# EAGLE schematic module_flags_calc (EAGLE 6.5.0)

## Sheet 1 of 14
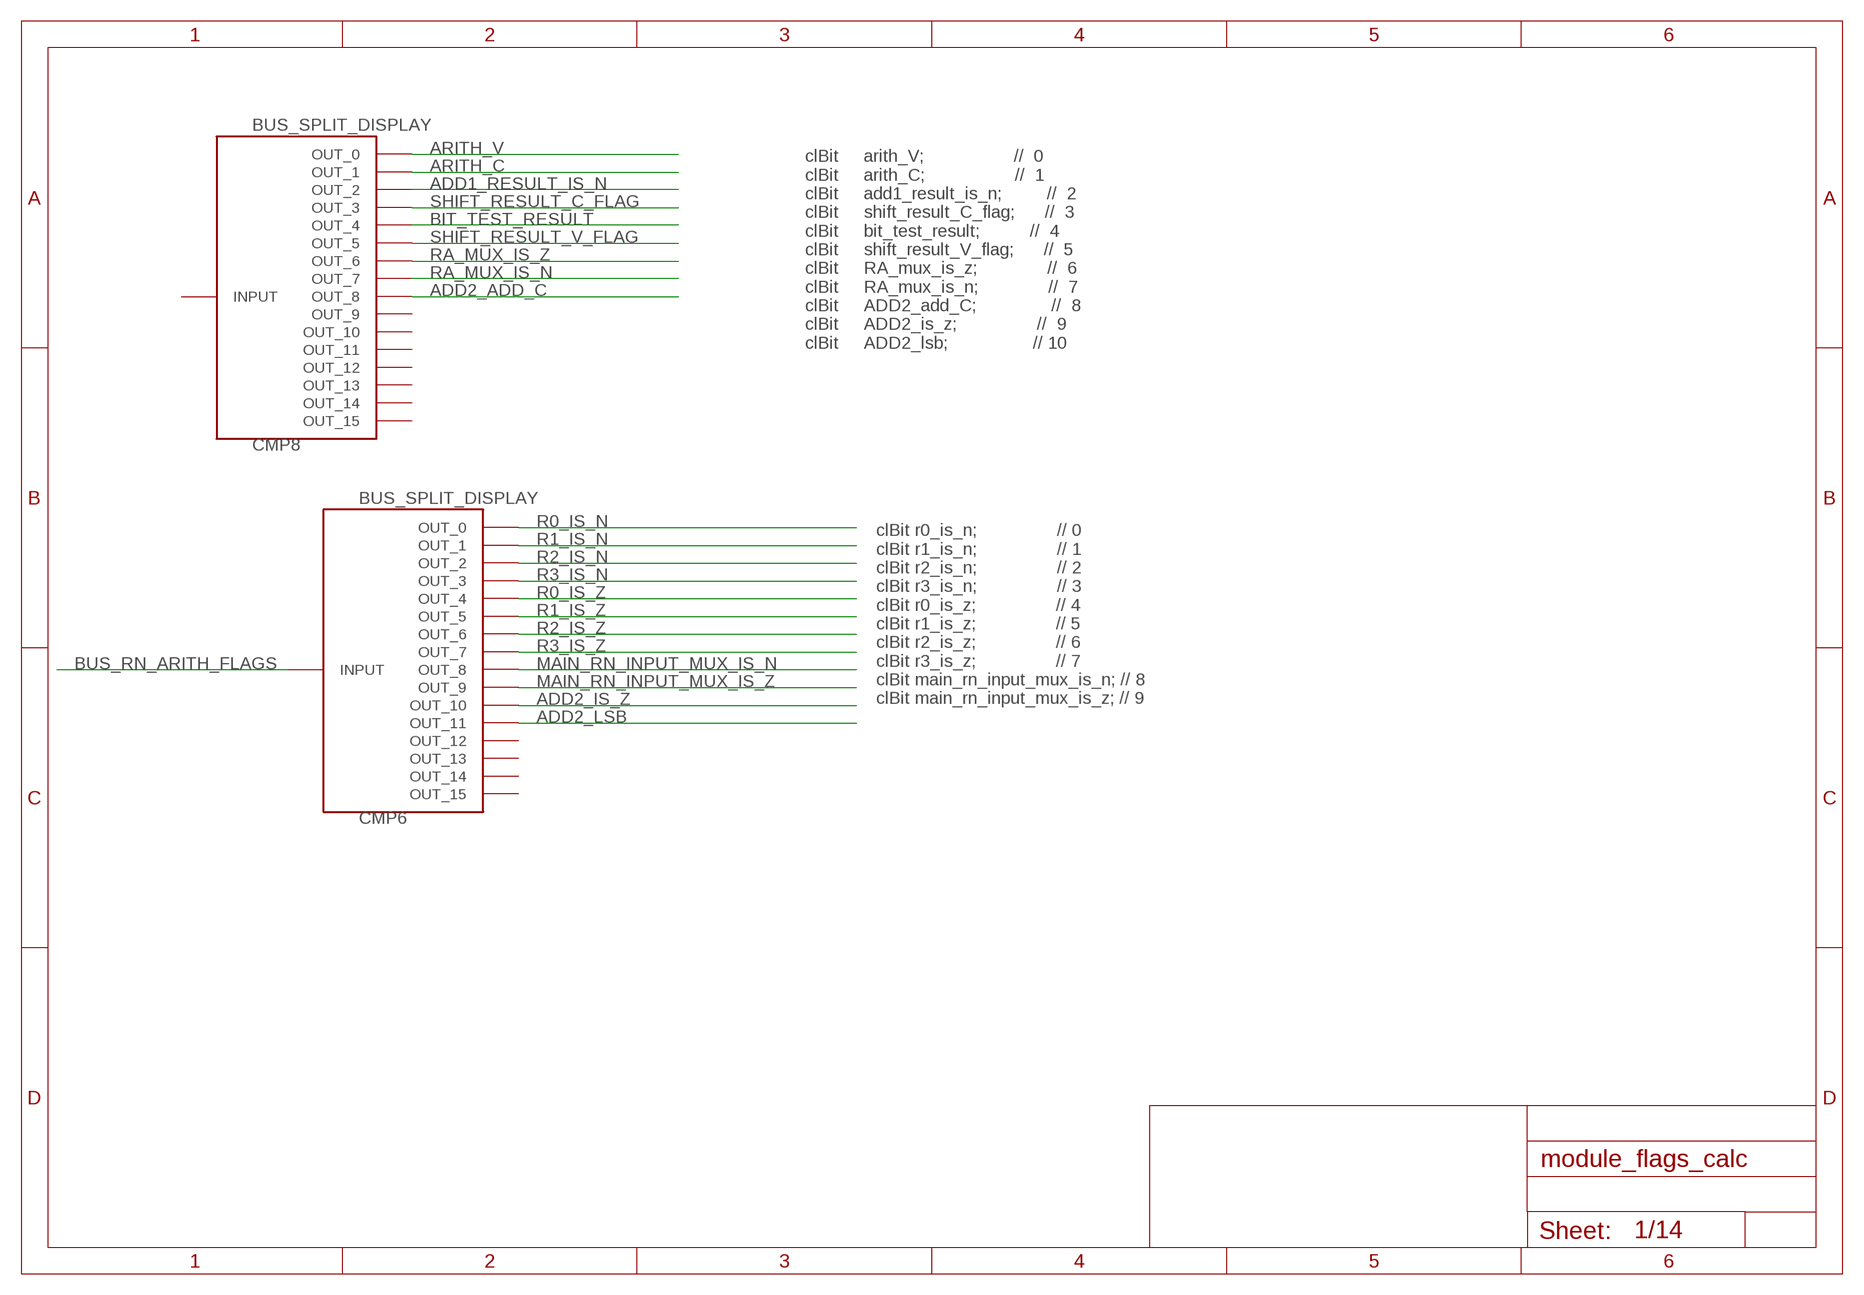
[diagram p0: schematic, sheet 1]

### Parts
CMP6  BUS_SPLIT_DISPLAY  [BUS_SPLIT_DISPLAY]
CMP8  BUS_SPLIT_DISPLAY  [BUS_SPLIT_DISPLAY]

### Nets
ADD1_RESULT_IS_N: CMP8.P$3(OUT_2) ; also sheet 7
ADD2_ADD_C: CMP8.P$9(OUT_8) ; also sheet 9
ADD2_IS_Z: CMP6.P$11(OUT_10) ; also sheet 11
ADD2_LSB: CMP6.P$12(OUT_11) ; also sheet 8
ARITH_C: CMP8.P$2(OUT_1) ; also sheet 8
ARITH_V: CMP8.P$1(OUT_0) ; also sheet 7
BIT_TEST_RESULT: CMP8.P$5(OUT_4) ; also sheet 11
BUS_RN_ARITH_FLAGS: CMP6.INPUT
MAIN_RN_INPUT_MUX_IS_N: CMP6.P$9(OUT_8) ; also sheet 10
MAIN_RN_INPUT_MUX_IS_Z: CMP6.P$10(OUT_9) ; also sheet 5,11
R0_IS_N: CMP6.P$1(OUT_0) ; also sheet 12
R0_IS_Z: CMP6.P$5(OUT_4)
R1_IS_N: CMP6.P$2(OUT_1) ; also sheet 12
R1_IS_Z: CMP6.P$6(OUT_5)
R2_IS_N: CMP6.P$3(OUT_2)
R2_IS_Z: CMP6.P$7(OUT_6)
R3_IS_N: CMP6.P$4(OUT_3)
R3_IS_Z: CMP6.P$8(OUT_7)
RA_MUX_IS_N: CMP8.P$8(OUT_7) ; also sheet 8,9,10
RA_MUX_IS_Z: CMP8.P$7(OUT_6) ; also sheet 11
SHIFT_RESULT_C_FLAG: CMP8.P$4(OUT_3) ; also sheet 8
SHIFT_RESULT_V_FLAG: CMP8.P$6(OUT_5) ; also sheet 5
Unconnected: CMP6.P$13(OUT_12) CMP6.P$14(OUT_13) CMP6.P$15(OUT_14) CMP6.P$16(OUT_15) CMP8.INPUT CMP8.P$10(OUT_9) CMP8.P$11(OUT_10) CMP8.P$12(OUT_11) CMP8.P$13(OUT_12) CMP8.P$14(OUT_13) CMP8.P$15(OUT_14) CMP8.P$16(OUT_15)

### Notes on the sheet
- clBit     arith_V;                  //  0
      clBit     arith_C;                  //  1
      clBit     add1_result_is_n;         //  2
      clBit     shift_result_C_flag;      //  3
      clBit     bit_test_result;          //  4
      clBit     shift_result_V_flag;      //  5
      clBit     RA_mux_is_z;              //  6
      clBit     RA_mux_is_n;              //  7
      clBit     ADD2_add_C;               //  8
      clBit     ADD2_is_z;                //  9
      clBit     ADD2_lsb;                 // 10
- clBit r0_is_n;                // 0
      clBit r1_is_n;                // 1
      clBit r2_is_n;                // 2
      clBit r3_is_n;                // 3
      clBit r0_is_z;                // 4
      clBit r1_is_z;                // 5
      clBit r2_is_z;                // 6
      clBit r3_is_z;                // 7
      clBit main_rn_input_mux_is_n; // 8 
      clBit main_rn_input_mux_is_z; // 9

## Sheet 2 of 14
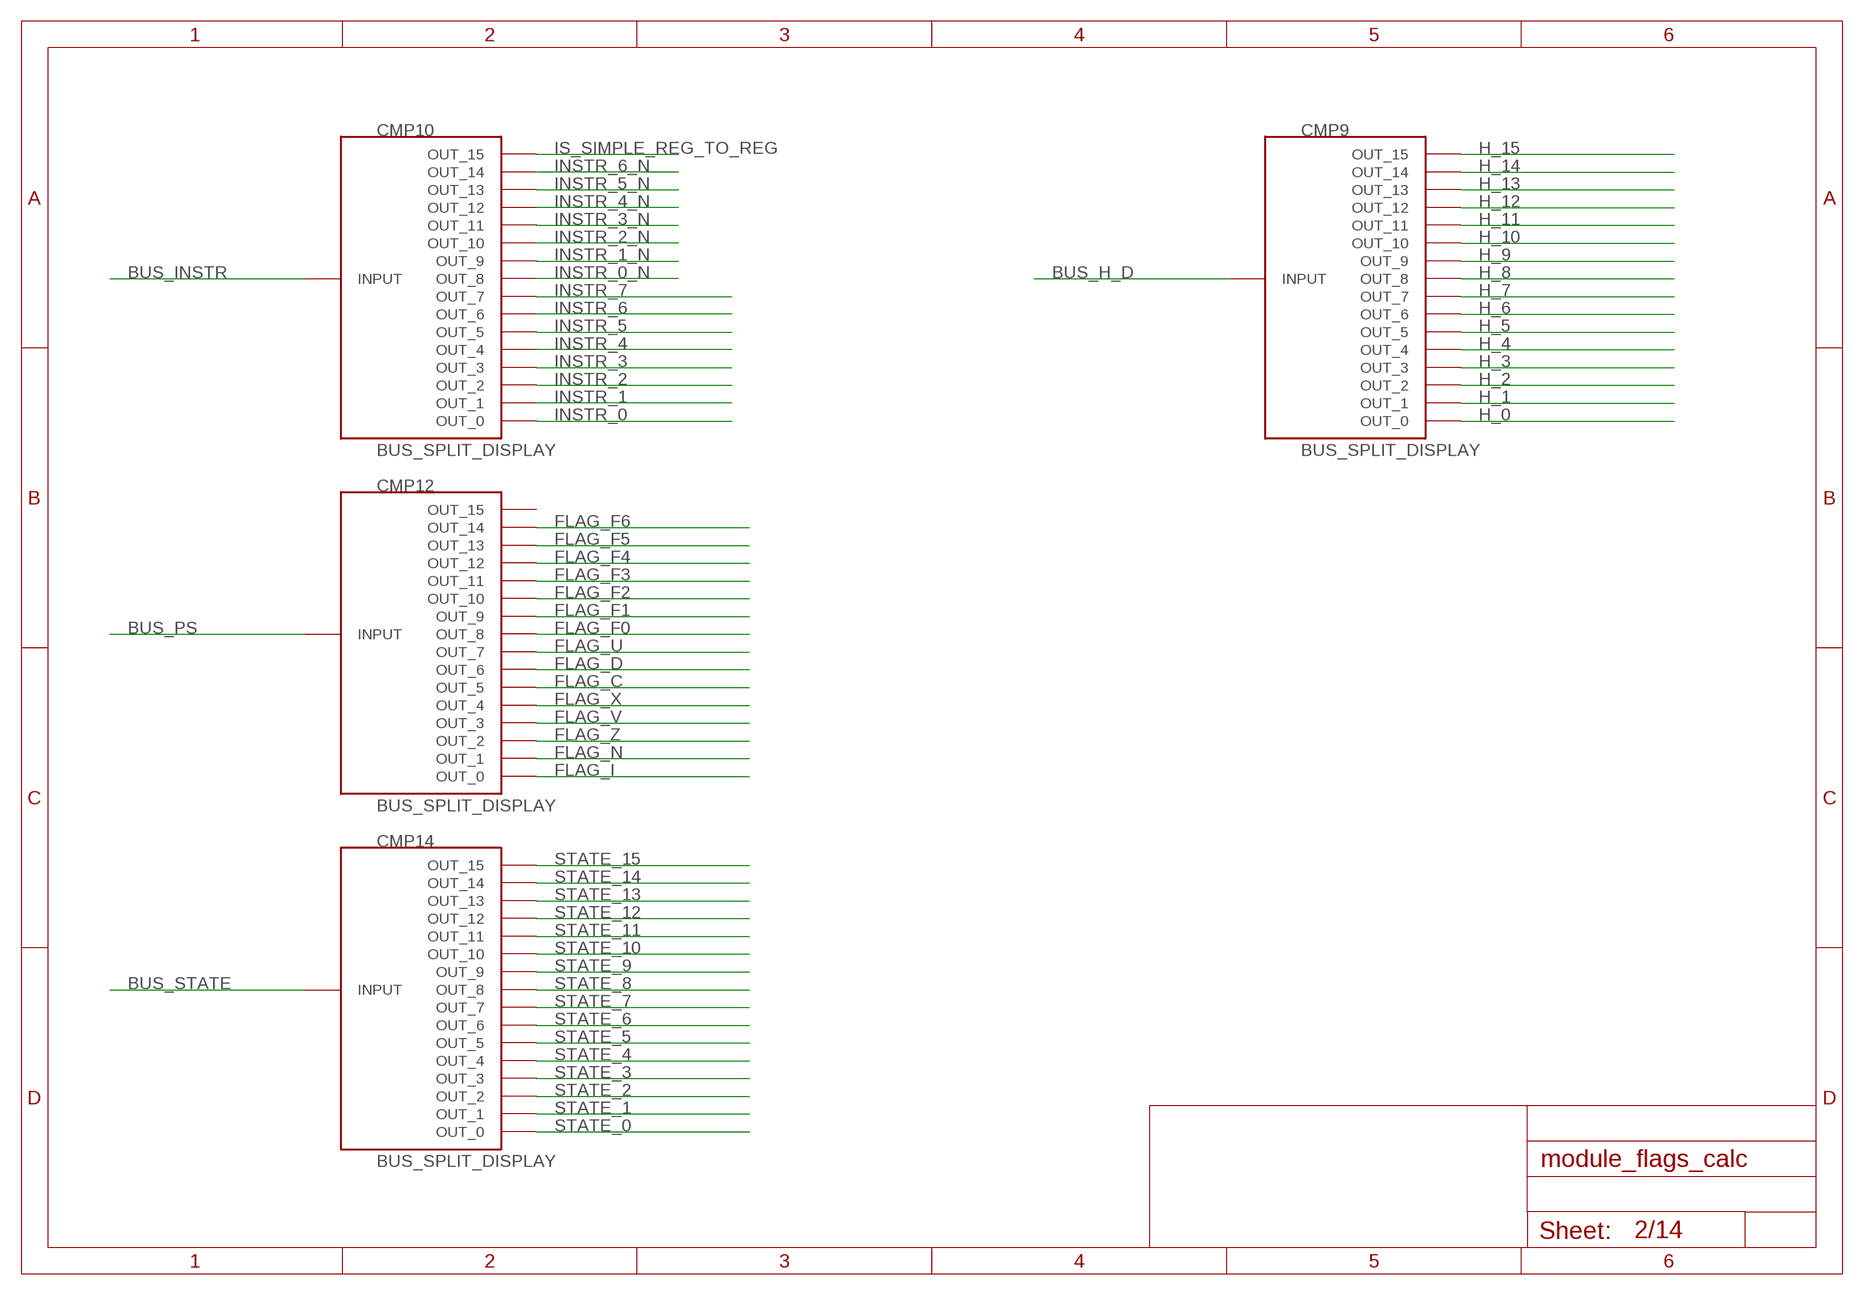
[diagram p1: schematic, sheet 2]

### Parts
CMP9  BUS_SPLIT_DISPLAY  [BUS_SPLIT_DISPLAY]
CMP10  BUS_SPLIT_DISPLAY  [BUS_SPLIT_DISPLAY]
CMP12  BUS_SPLIT_DISPLAY  [BUS_SPLIT_DISPLAY]
CMP14  BUS_SPLIT_DISPLAY  [BUS_SPLIT_DISPLAY]

### Nets
BUS_H_D: CMP9.INPUT
BUS_INSTR: CMP10.INPUT
BUS_PS: CMP12.INPUT
BUS_STATE: CMP14.INPUT
FLAG_C: CMP12.P$6(OUT_5) ; also sheet 8
FLAG_D: CMP12.P$7(OUT_6) ; also sheet 4
FLAG_F0: CMP12.P$9(OUT_8) ; also sheet 12
FLAG_F1: CMP12.P$10(OUT_9) ; also sheet 12
FLAG_F2: CMP12.P$11(OUT_10)
FLAG_F3: CMP12.P$12(OUT_11)
FLAG_F4: CMP12.P$13(OUT_12) ; also sheet 13
FLAG_F5: CMP12.P$14(OUT_13) ; also sheet 13
FLAG_F6: CMP12.P$15(OUT_14) ; also sheet 8,13
FLAG_I: CMP12.P$1(OUT_0) ; also sheet 5
FLAG_N: CMP12.P$2(OUT_1) ; also sheet 10
FLAG_U: CMP12.P$8(OUT_7) ; also sheet 4
FLAG_V: CMP12.P$4(OUT_3) ; also sheet 5,7
FLAG_X: CMP12.P$5(OUT_4) ; also sheet 8,9
FLAG_Z: CMP12.P$3(OUT_2) ; also sheet 5,11
H_0: CMP9.P$1(OUT_0)
H_1: CMP9.P$2(OUT_1)
H_2: CMP9.P$3(OUT_2)
H_3: CMP9.P$4(OUT_3) ; also sheet 13
H_4: CMP9.P$5(OUT_4) ; also sheet 7
H_5: CMP9.P$6(OUT_5) ; also sheet 13
H_6: CMP9.P$7(OUT_6)
H_7: CMP9.P$8(OUT_7)
H_8: CMP9.P$9(OUT_8)
H_9: CMP9.P$10(OUT_9)
H_10: CMP9.P$11(OUT_10)
H_11: CMP9.P$12(OUT_11)
H_12: CMP9.P$13(OUT_12)
H_13: CMP9.P$14(OUT_13)
H_14: CMP9.P$15(OUT_14)
H_15: CMP9.P$16(OUT_15)
INSTR_0: CMP10.P$1(OUT_0) ; also sheet 3
INSTR_0_N: CMP10.P$9(OUT_8)
INSTR_1: CMP10.P$2(OUT_1) ; also sheet 3
INSTR_1_N: CMP10.P$10(OUT_9)
INSTR_2: CMP10.P$3(OUT_2) ; also sheet 3
INSTR_2_N: CMP10.P$11(OUT_10)
INSTR_3: CMP10.P$4(OUT_3) ; also sheet 3,10
INSTR_3_N: CMP10.P$12(OUT_11)
INSTR_4: CMP10.P$5(OUT_4)
INSTR_4_N: CMP10.P$13(OUT_12)
INSTR_5: CMP10.P$6(OUT_5)
INSTR_5_N: CMP10.P$14(OUT_13)
INSTR_6: CMP10.P$7(OUT_6)
INSTR_6_N: CMP10.P$15(OUT_14) ; also sheet 6
INSTR_7: CMP10.P$8(OUT_7)
IS_SIMPLE_REG_TO_REG: CMP10.P$16(OUT_15) ; also sheet 10
STATE_0: CMP14.P$1(OUT_0) ; also sheet 6,10,12
STATE_1: CMP14.P$2(OUT_1) ; also sheet 13
STATE_2: CMP14.P$3(OUT_2)
STATE_3: CMP14.P$4(OUT_3) ; also sheet 5,6,8,11,14
STATE_4: CMP14.P$5(OUT_4)
STATE_5: CMP14.P$6(OUT_5) ; also sheet 14
STATE_6: CMP14.P$7(OUT_6)
STATE_7: CMP14.P$8(OUT_7)
STATE_8: CMP14.P$9(OUT_8) ; also sheet 14
STATE_9: CMP14.P$10(OUT_9) ; also sheet 5
STATE_10: CMP14.P$11(OUT_10)
STATE_11: CMP14.P$12(OUT_11)
STATE_12: CMP14.P$13(OUT_12)
STATE_13: CMP14.P$14(OUT_13) ; also sheet 9,12
STATE_14: CMP14.P$15(OUT_14)
STATE_15: CMP14.P$16(OUT_15)
Unconnected: CMP12.P$16(OUT_15)

## Sheet 3 of 14
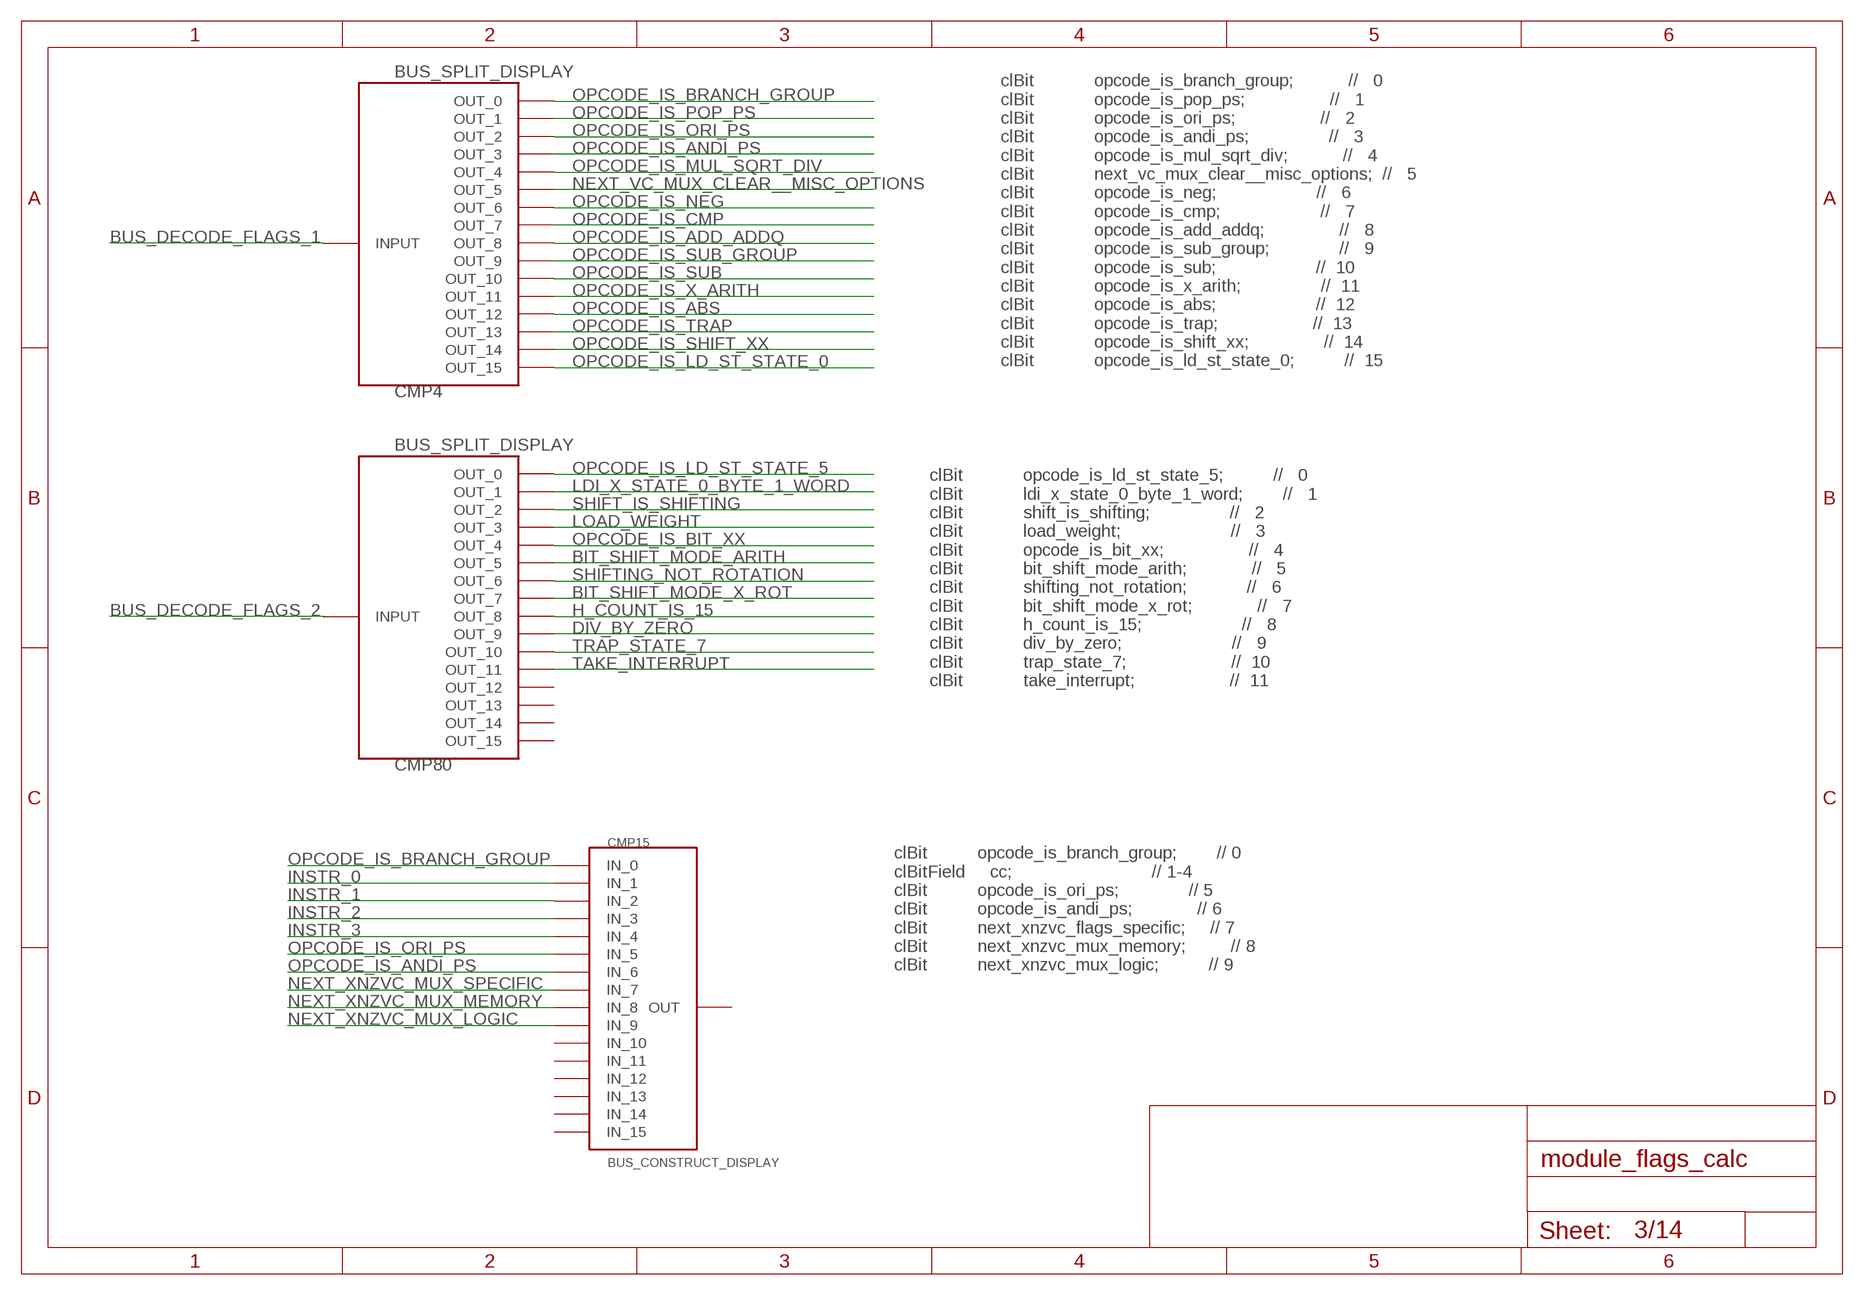
[diagram p2: schematic, sheet 3]

### Parts
CMP4  BUS_SPLIT_DISPLAY  [BUS_SPLIT_DISPLAY]
CMP15  BUS_CONSTRUCT_DISPLAY  [BUS_SPLIT_DISPLAY]
CMP80  BUS_SPLIT_DISPLAY  [BUS_SPLIT_DISPLAY]

### Nets
BIT_SHIFT_MODE_ARITH: CMP80.P$6(OUT_5) ; also sheet 7
BIT_SHIFT_MODE_X_ROT: CMP80.P$8(OUT_7) ; also sheet 8
BUS_DECODE_FLAGS_1: CMP4.INPUT
BUS_DECODE_FLAGS_2: CMP80.INPUT
DIV_BY_ZERO: CMP80.P$10(OUT_9) ; also sheet 13
H_COUNT_IS_15: CMP80.P$9(OUT_8) ; also sheet 12
INSTR_0: CMP15.P$2(IN_1) ; also sheet 2
INSTR_1: CMP15.P$3(IN_2) ; also sheet 2
INSTR_2: CMP15.P$4(IN_3) ; also sheet 2
INSTR_3: CMP15.P$5(IN_4) ; also sheet 2,10
LDI_X_STATE_0_BYTE_1_WORD: CMP80.P$2(OUT_1) ; also sheet 10
LOAD_WEIGHT: CMP80.P$4(OUT_3) ; also sheet 7,8,9,10,11
NEXT_VC_MUX_CLEAR__MISC_OPTIONS: CMP4.P$6(OUT_5) ; also sheet 6
NEXT_XNZVC_MUX_LOGIC: CMP15.P$10(IN_9) ; also sheet 14
NEXT_XNZVC_MUX_MEMORY: CMP15.P$9(IN_8) ; also sheet 14
NEXT_XNZVC_MUX_SPECIFIC: CMP15.P$8(IN_7) ; also sheet 14
OPCODE_IS_ABS: CMP4.P$13(OUT_12) ; also sheet 6,7,8,9
OPCODE_IS_ADD_ADDQ: CMP4.P$9(OUT_8) ; also sheet 5,9
OPCODE_IS_ANDI_PS: CMP4.P$4(OUT_3) CMP15.P$7(IN_6) ; also sheet 14
OPCODE_IS_BIT_XX: CMP80.P$5(OUT_4) ; also sheet 11
OPCODE_IS_BRANCH_GROUP: CMP4.P$1(OUT_0) CMP15.P$1(IN_0)
OPCODE_IS_CMP: CMP4.P$8(OUT_7) ; also sheet 5
OPCODE_IS_LD_ST_STATE_0: CMP4.P$16(OUT_15) ; also sheet 10
OPCODE_IS_LD_ST_STATE_5: CMP80.P$1(OUT_0) ; also sheet 10
OPCODE_IS_MUL_SQRT_DIV: CMP4.P$5(OUT_4) ; also sheet 5,6
OPCODE_IS_NEG: CMP4.P$7(OUT_6) ; also sheet 5
OPCODE_IS_ORI_PS: CMP4.P$3(OUT_2) CMP15.P$6(IN_5) ; also sheet 14
OPCODE_IS_POP_PS: CMP4.P$2(OUT_1) ; also sheet 14
OPCODE_IS_SHIFT_XX: CMP4.P$15(OUT_14) ; also sheet 8,10
OPCODE_IS_SUB: CMP4.P$11(OUT_10) ; also sheet 5
OPCODE_IS_SUB_GROUP: CMP4.P$10(OUT_9) ; also sheet 9
OPCODE_IS_TRAP: CMP4.P$14(OUT_13) ; also sheet 5
OPCODE_IS_X_ARITH: CMP4.P$12(OUT_11) ; also sheet 5,9,10,11
SHIFT_IS_SHIFTING: CMP80.P$3(OUT_2) ; also sheet 7,8,10
SHIFTING_NOT_ROTATION: CMP80.P$7(OUT_6) ; also sheet 9
TAKE_INTERRUPT: CMP80.P$12(OUT_11) ; also sheet 13
TRAP_STATE_7: CMP80.P$11(OUT_10) ; also sheet 13
Unconnected: CMP15.INPUT(OUT) CMP15.P$11(IN_10) CMP15.P$12(IN_11) CMP15.P$13(IN_12) CMP15.P$14(IN_13) CMP15.P$15(IN_14) CMP15.P$16(IN_15) CMP80.P$13(OUT_12) CMP80.P$14(OUT_13) CMP80.P$15(OUT_14) CMP80.P$16(OUT_15)

### Notes on the sheet
- clBit            opcode_is_branch_group;           //   0
      clBit            opcode_is_pop_ps;                 //   1
      clBit            opcode_is_ori_ps;                 //   2
      clBit            opcode_is_andi_ps;                //   3
      clBit            opcode_is_mul_sqrt_div;           //   4
      clBit            next_vc_mux_clear__misc_options;  //   5
      clBit            opcode_is_neg;                    //   6
      clBit            opcode_is_cmp;                    //   7
      clBit            opcode_is_add_addq;               //   8
      clBit            opcode_is_sub_group;              //   9
      clBit            opcode_is_sub;                    //  10
      clBit            opcode_is_x_arith;                //  11
      clBit            opcode_is_abs;                    //  12
      clBit            opcode_is_trap;                   //  13
      clBit            opcode_is_shift_xx;               //  14
      clBit            opcode_is_ld_st_state_0;          //  15
- clBit            opcode_is_ld_st_state_5;          //   0
      clBit            ldi_x_state_0_byte_1_word;        //   1
      clBit            shift_is_shifting;                //   2
      clBit            load_weight;                      //   3
      clBit            opcode_is_bit_xx;                 //   4
      clBit            bit_shift_mode_arith;             //   5
      clBit            shifting_not_rotation;            //   6
      clBit            bit_shift_mode_x_rot;             //   7
      clBit            h_count_is_15;                    //   8
      clBit            div_by_zero;                      //   9
      clBit            trap_state_7;                     //  10
      clBit            take_interrupt;                   //  11
- clBit          opcode_is_branch_group;        // 0
      clBitField     cc;                            // 1-4
      clBit          opcode_is_ori_ps;              // 5
      clBit          opcode_is_andi_ps;             // 6
      clBit          next_xnzvc_flags_specific;     // 7
      clBit          next_xnzvc_mux_memory;         // 8
      clBit          next_xnzvc_mux_logic;          // 9

## Sheet 4 of 14
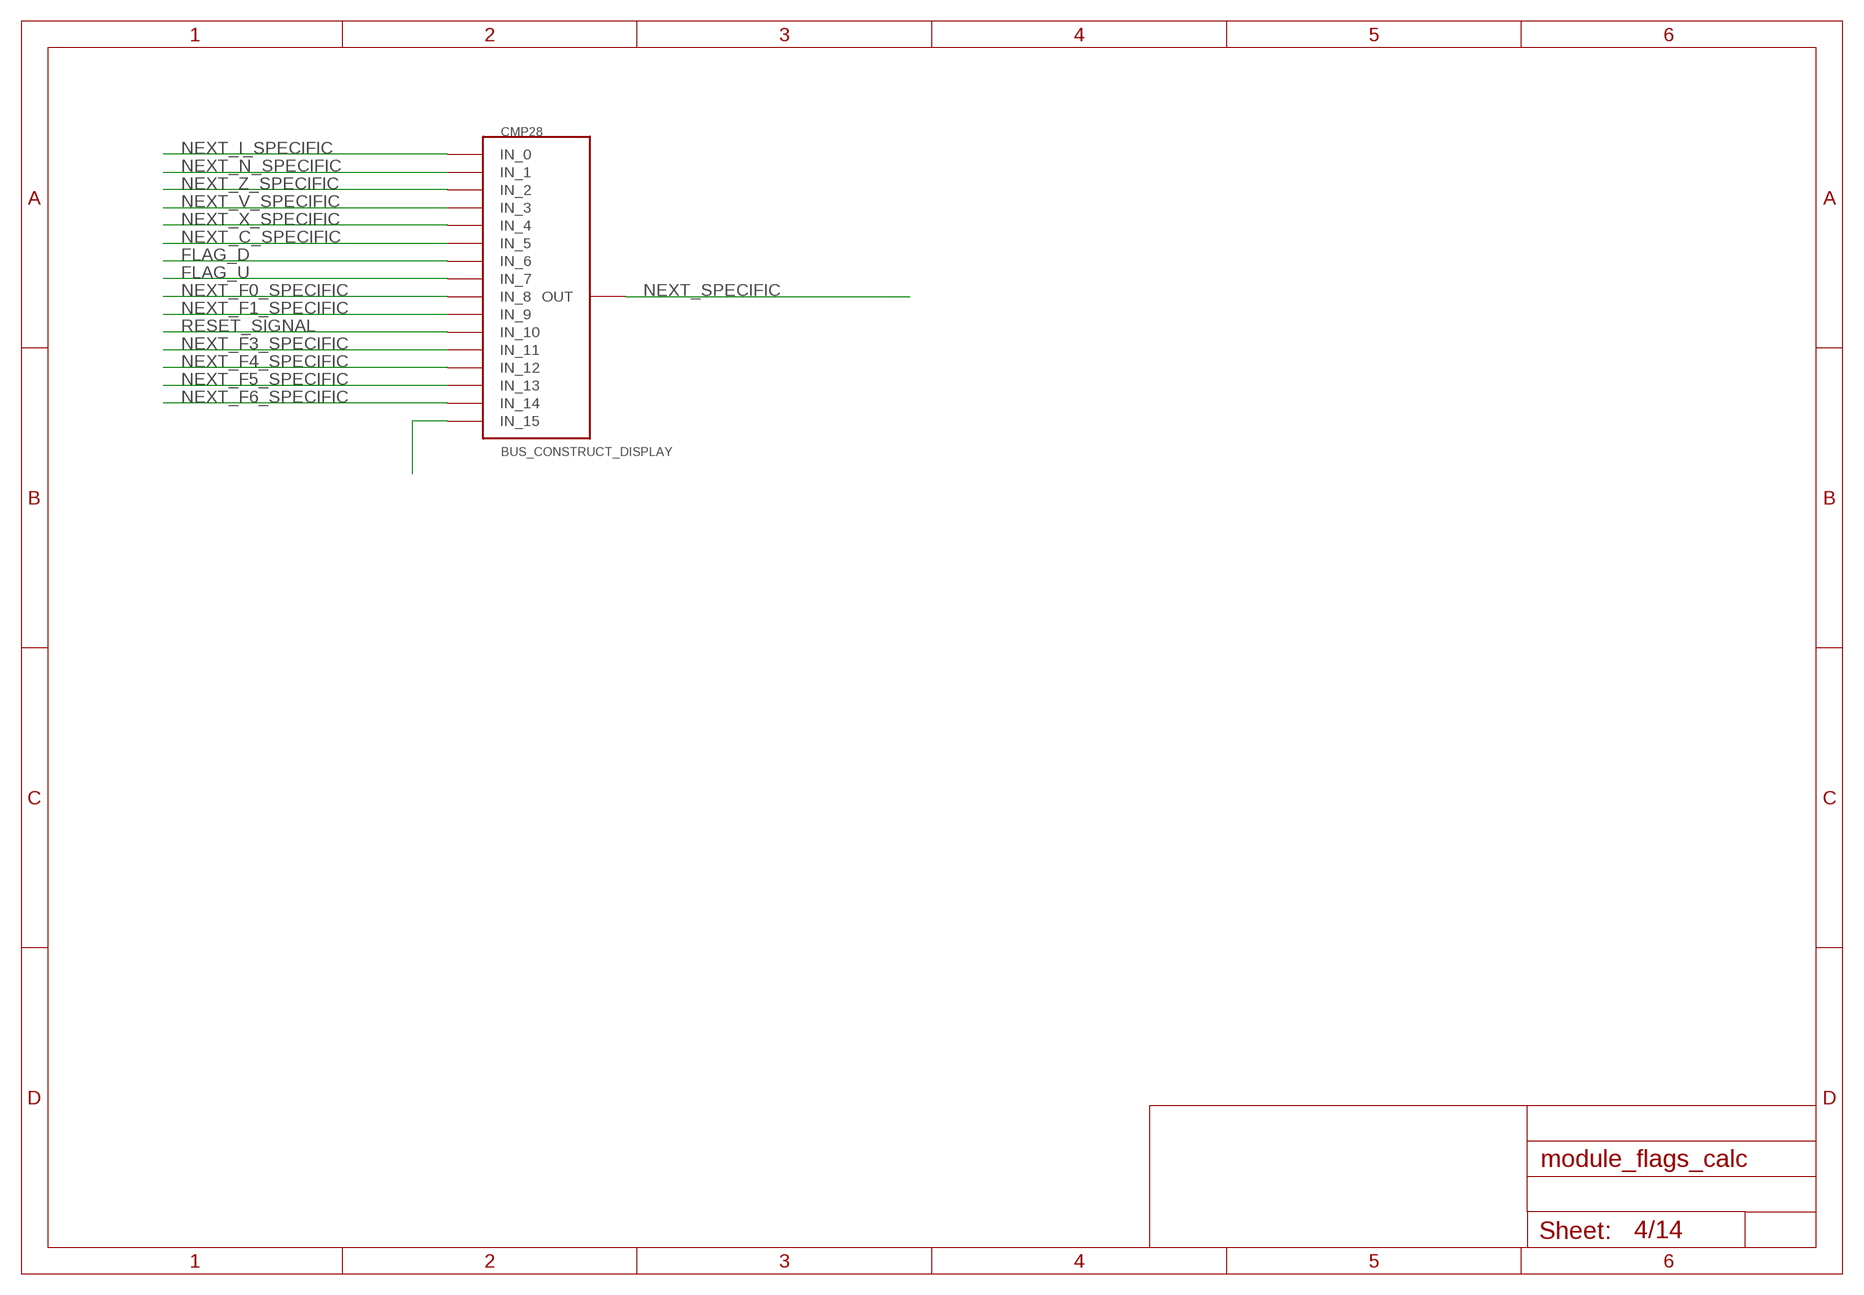
[diagram p3: schematic, sheet 4]

### Parts
CMP28  BUS_CONSTRUCT_DISPLAY  [BUS_SPLIT_DISPLAY]

### Nets
FLAG_D: CMP28.P$7(IN_6) ; also sheet 2
FLAG_U: CMP28.P$8(IN_7) ; also sheet 2
N$17: CMP28.P$16(IN_15)
NEXT_C_SPECIFIC: CMP28.P$6(IN_5) ; also sheet 8,9
NEXT_F0_SPECIFIC: CMP28.P$9(IN_8) ; also sheet 12
NEXT_F1_SPECIFIC: CMP28.P$10(IN_9) ; also sheet 12
NEXT_F3_SPECIFIC: CMP28.P$12(IN_11) ; also sheet 12
NEXT_F4_SPECIFIC: CMP28.P$13(IN_12) ; also sheet 13
NEXT_F5_SPECIFIC: CMP28.P$14(IN_13) ; also sheet 13
NEXT_F6_SPECIFIC: CMP28.P$15(IN_14) ; also sheet 13
NEXT_I_SPECIFIC: CMP28.P$1(IN_0) ; also sheet 5
NEXT_N_SPECIFIC: CMP28.P$2(IN_1) ; also sheet 10
NEXT_SPECIFIC: CMP28.INPUT(OUT)
NEXT_V_SPECIFIC: CMP28.P$4(IN_3) ; also sheet 7
NEXT_X_SPECIFIC: CMP28.P$5(IN_4) ; also sheet 9
NEXT_Z_SPECIFIC: CMP28.P$3(IN_2) ; also sheet 11
RESET_SIGNAL: CMP28.P$11(IN_10)

## Sheet 5 of 14
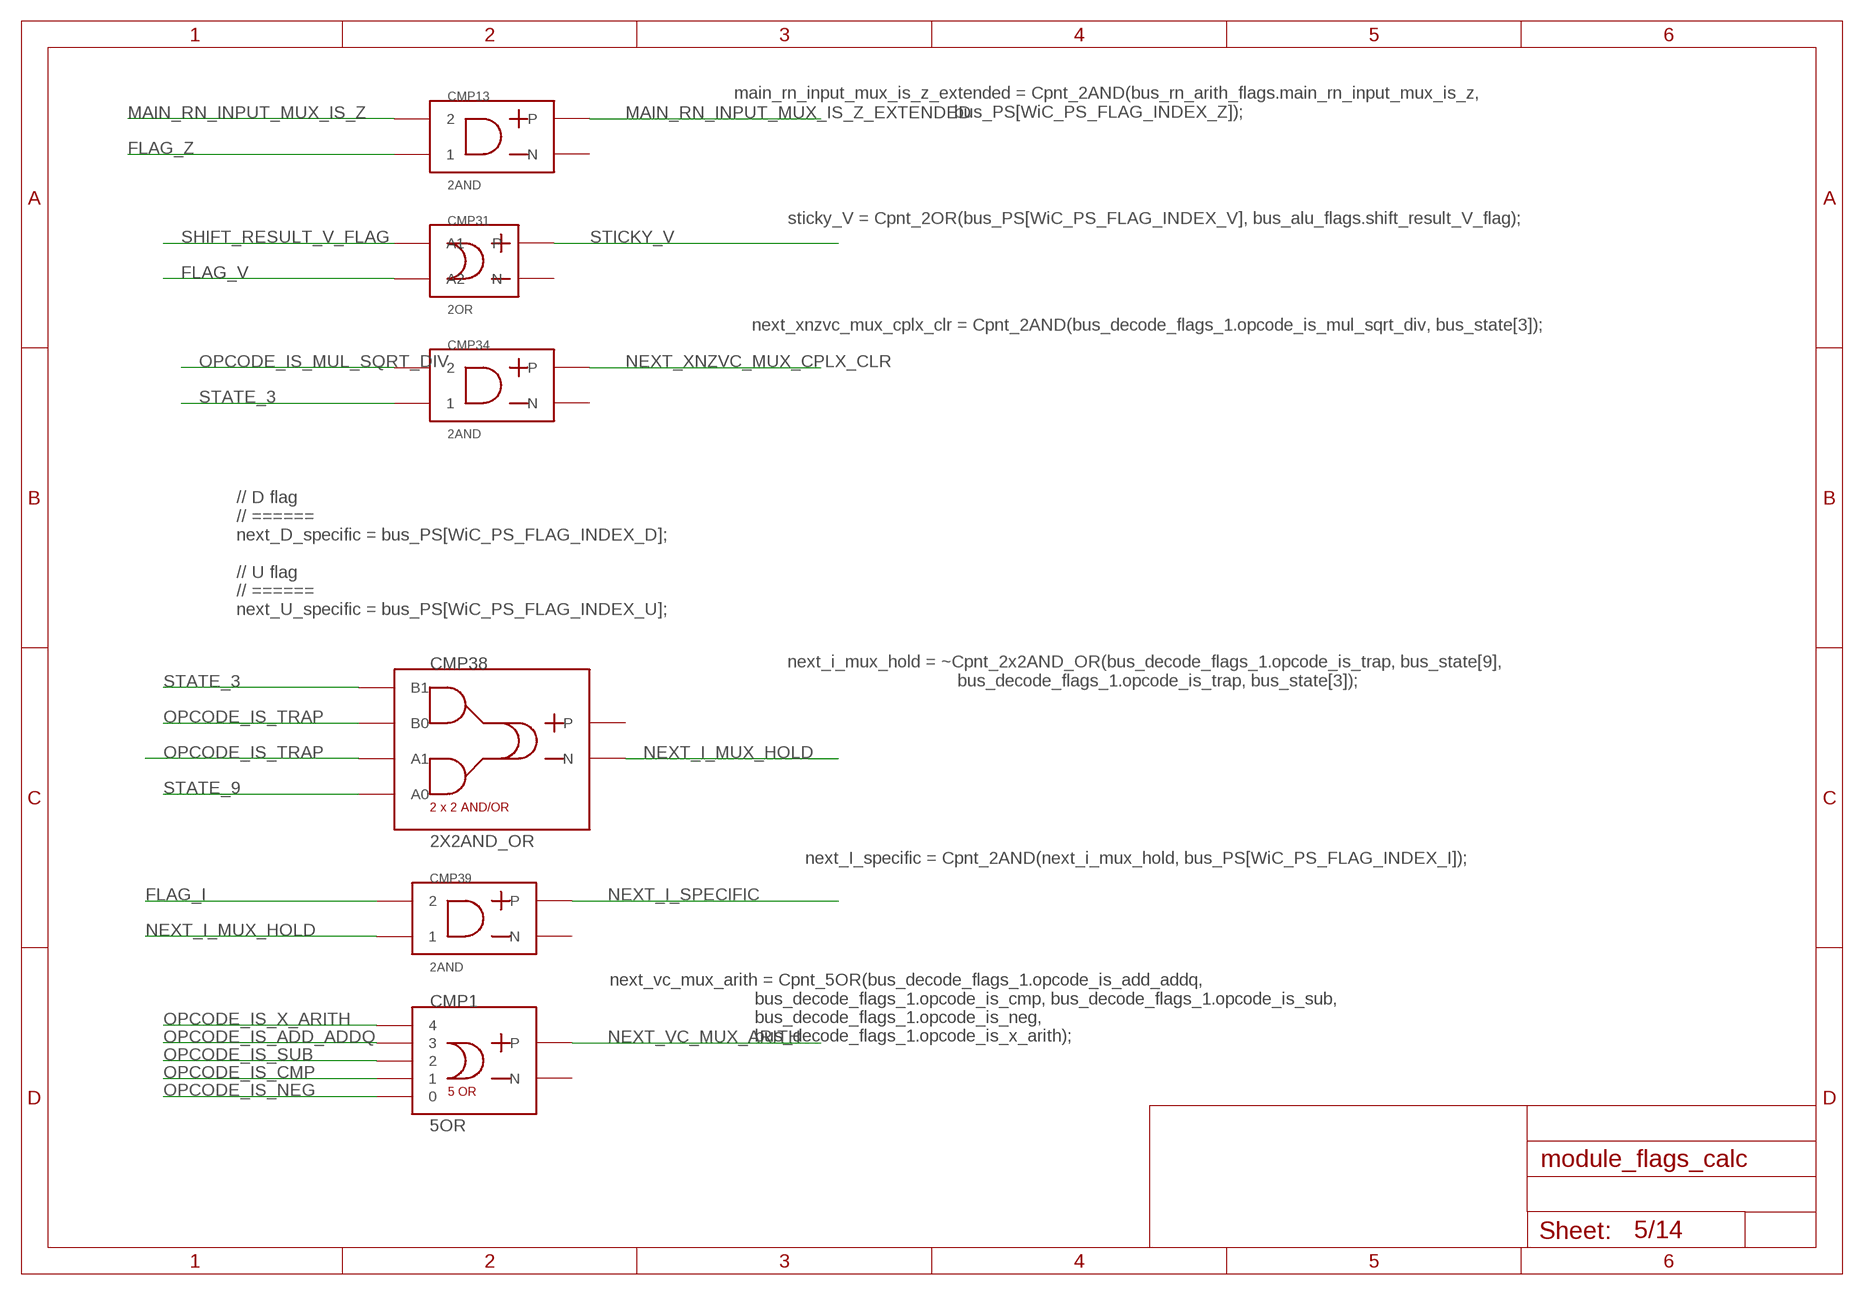
[diagram p4: schematic, sheet 5]

### Parts
CMP1  5OR  [5OR]
CMP13  2AND  [2AND]
CMP31  2OR  [2OR]
CMP34  2AND  [2AND]
CMP38  2X2AND_OR  [2X2AND_OR]
CMP39  2AND  [2AND]

### Nets
FLAG_I: CMP39.P$2 ; also sheet 2
FLAG_V: CMP31.P$1(A2) ; also sheet 2,7
FLAG_Z: CMP13.P$1 ; also sheet 2,11
MAIN_RN_INPUT_MUX_IS_Z: CMP13.P$2 ; also sheet 1,11
MAIN_RN_INPUT_MUX_IS_Z_EXTENDED: CMP13.OUT_P(P) ; also sheet 11
NEXT_I_MUX_HOLD: CMP38.OUT_M(N) CMP39.P$1
NEXT_I_SPECIFIC: CMP39.OUT_P(P) ; also sheet 4
NEXT_VC_MUX_ARITH: CMP1.OUT_P(P) ; also sheet 6,7,8
NEXT_XNZVC_MUX_CPLX_CLR: CMP34.OUT_P(P) ; also sheet 9,10,11
OPCODE_IS_ADD_ADDQ: CMP1.4 ; also sheet 3,9
OPCODE_IS_CMP: CMP1.2 ; also sheet 3
OPCODE_IS_MUL_SQRT_DIV: CMP34.P$2 ; also sheet 3,6
OPCODE_IS_NEG: CMP1.1 ; also sheet 3
OPCODE_IS_SUB: CMP1.3 ; also sheet 3
OPCODE_IS_TRAP: CMP38.P$2(A1) CMP38.P$3(B0) ; also sheet 3
OPCODE_IS_X_ARITH: CMP1.5 ; also sheet 3,9,10,11
SHIFT_RESULT_V_FLAG: CMP31.P$2(A1) ; also sheet 1
STATE_3: CMP34.P$1 CMP38.P$4(B1) ; also sheet 2,6,8,11,14
STATE_9: CMP38.P$1(A0) ; also sheet 2
STICKY_V: CMP31.OUT_P(P) ; also sheet 7
Unconnected: CMP1.OUT_M(N) CMP13.OUT_M(N) CMP31.OUT_M(N) CMP34.OUT_M(N) CMP38.OUT_P(P) CMP39.OUT_M(N)

### Notes on the sheet
- main_rn_input_mux_is_z_extended = Cpnt_2AND(bus_rn_arith_flags.main_rn_input_mux_is_z,
                                                  bus_PS[WiC_PS_FLAG_INDEX_Z]);
- sticky_V = Cpnt_2OR(bus_PS[WiC_PS_FLAG_INDEX_V], bus_alu_flags.shift_result_V_flag);
- next_xnzvc_mux_cplx_clr = Cpnt_2AND(bus_decode_flags_1.opcode_is_mul_sqrt_div, bus_state[3]);
- // D flag
      // ======
      next_D_specific = bus_PS[WiC_PS_FLAG_INDEX_D];
  
      // U flag
      // ======
      next_U_specific = bus_PS[WiC_PS_FLAG_INDEX_U];
- next_i_mux_hold = ~Cpnt_2x2AND_OR(bus_decode_flags_1.opcode_is_trap, bus_state[9],  
                                        bus_decode_flags_1.opcode_is_trap, bus_state[3]);
- next_I_specific = Cpnt_2AND(next_i_mux_hold, bus_PS[WiC_PS_FLAG_INDEX_I]);
- next_vc_mux_arith = Cpnt_5OR(bus_decode_flags_1.opcode_is_add_addq, 
                                   bus_decode_flags_1.opcode_is_cmp, bus_decode_flags_1.opcode_is_sub,   
                                   bus_decode_flags_1.opcode_is_neg,    
                                   bus_decode_flags_1.opcode_is_x_arith);

## Sheet 6 of 14
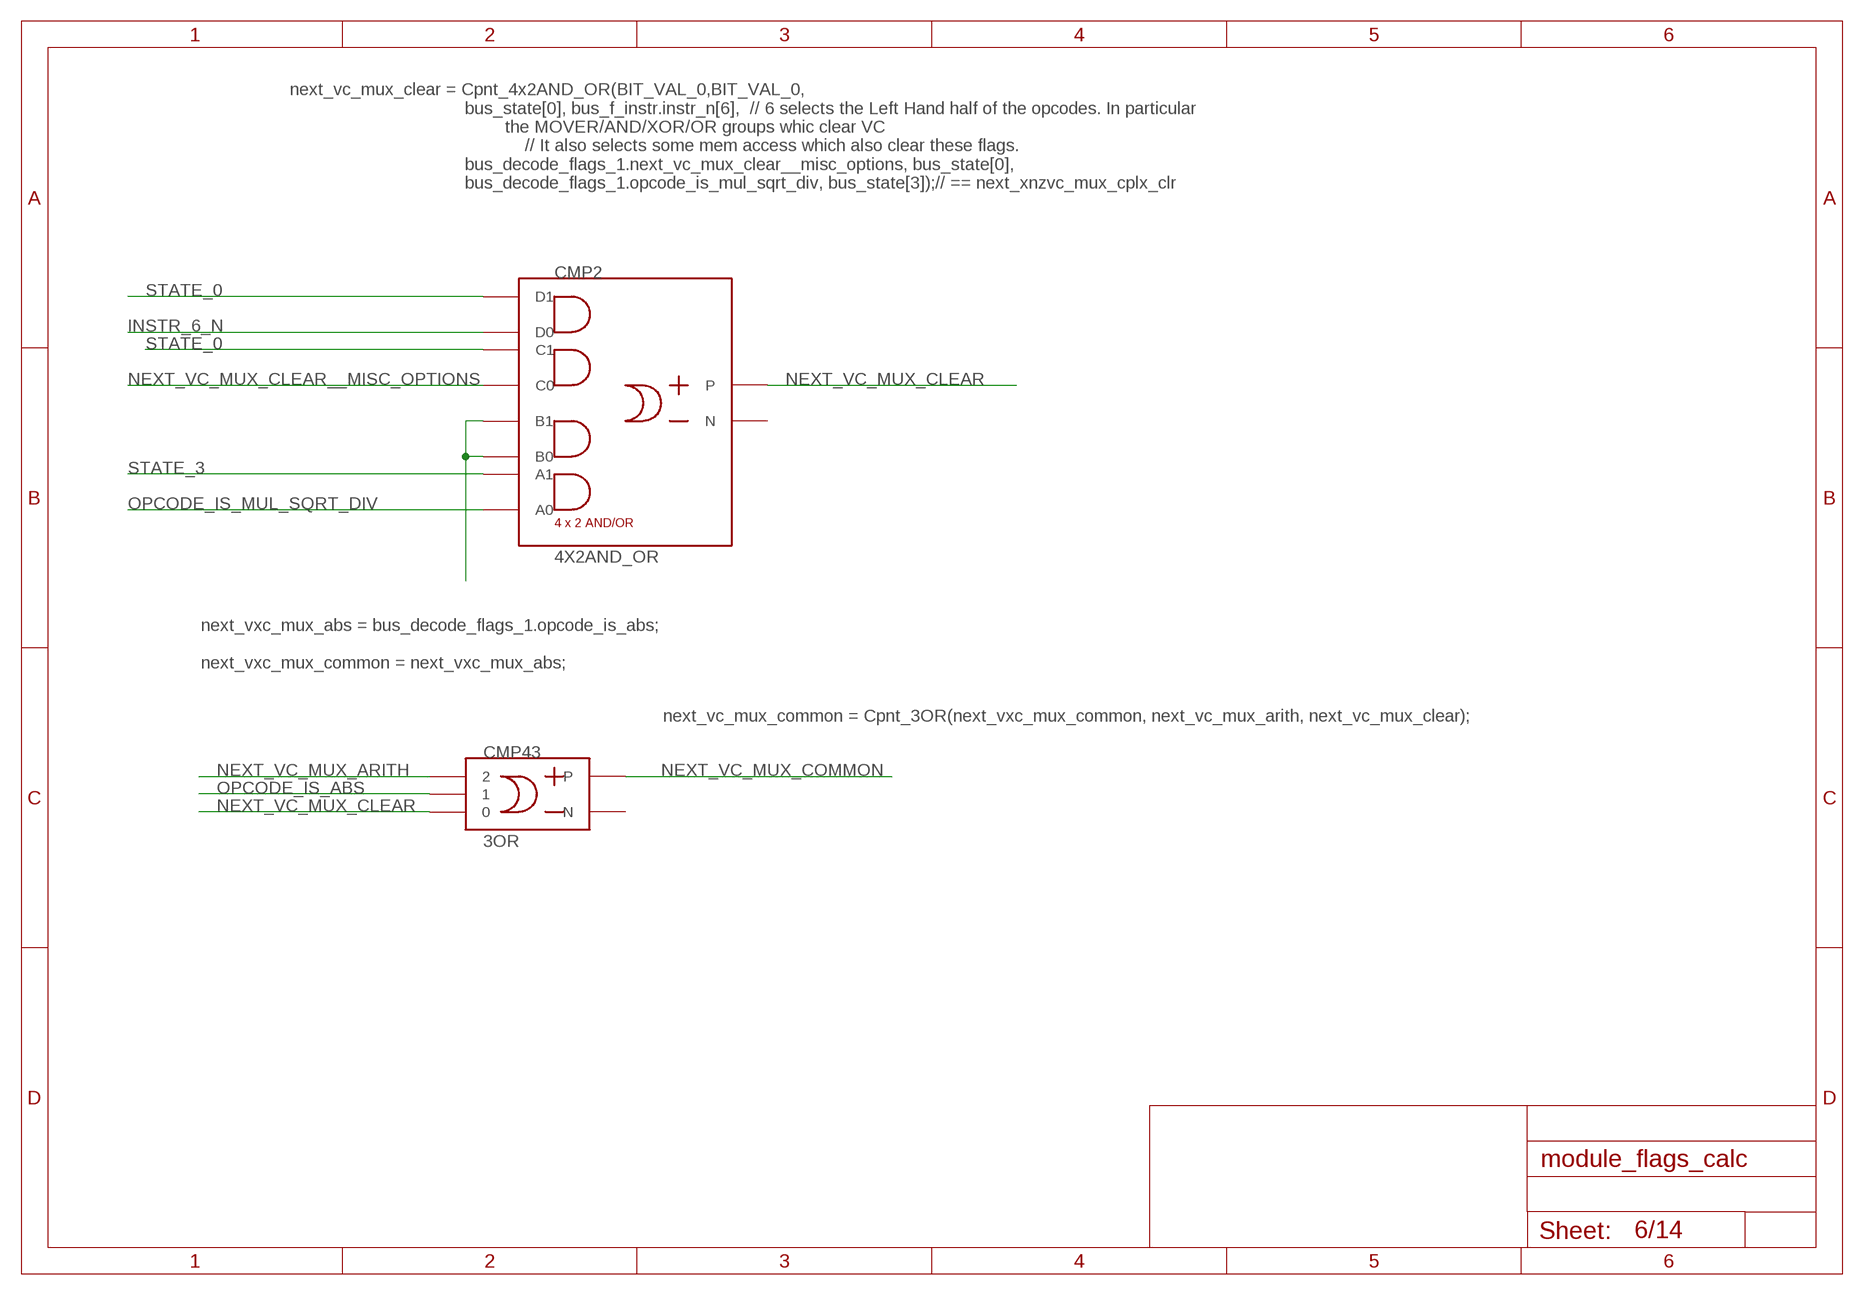
[diagram p5: schematic, sheet 6]

### Parts
CMP2  4X2AND_OR  [4X2AND_OR]
CMP43  3OR  [3OR]

### Nets
INSTR_6_N: CMP2.P$7(D0) ; also sheet 2
N$1: CMP2.P$3(B0) CMP2.P$4(B1)
NEXT_VC_MUX_ARITH: CMP43.P$3 ; also sheet 5,7,8
NEXT_VC_MUX_CLEAR: CMP2.OUT_P(P) CMP43.P$1
NEXT_VC_MUX_CLEAR__MISC_OPTIONS: CMP2.P$5(C0) ; also sheet 3
NEXT_VC_MUX_COMMON: CMP43.OUT_P(P) ; also sheet 7,8
OPCODE_IS_ABS: CMP43.P$2 ; also sheet 3,7,8,9
OPCODE_IS_MUL_SQRT_DIV: CMP2.P$1(A0) ; also sheet 3,5
STATE_0: CMP2.P$6(C1) CMP2.P$8(D1) ; also sheet 2,10,12
STATE_3: CMP2.P$2(A1) ; also sheet 2,5,8,11,14
Unconnected: CMP2.OUT_M(N) CMP43.OUT_M(N)

### Notes on the sheet
- next_vc_mux_clear = Cpnt_4x2AND_OR(BIT_VAL_0,BIT_VAL_0,
                                         bus_state[0], bus_f_instr.instr_n[6],  // 6 selects the Left Hand half of the opcodes. In particular 
                                                 the MOVER/AND/XOR/OR groups whic clear VC
                                                     // It also selects some mem access which also clear these flags.
                                         bus_decode_flags_1.next_vc_mux_clear__misc_options, bus_state[0],
                                         bus_decode_flags_1.opcode_is_mul_sqrt_div, bus_state[3]);// == next_xnzvc_mux_cplx_clr
- next_vxc_mux_abs = bus_decode_flags_1.opcode_is_abs;
  
      next_vxc_mux_common = next_vxc_mux_abs;
- next_vc_mux_common = Cpnt_3OR(next_vxc_mux_common, next_vc_mux_arith, next_vc_mux_clear);

## Sheet 7 of 14
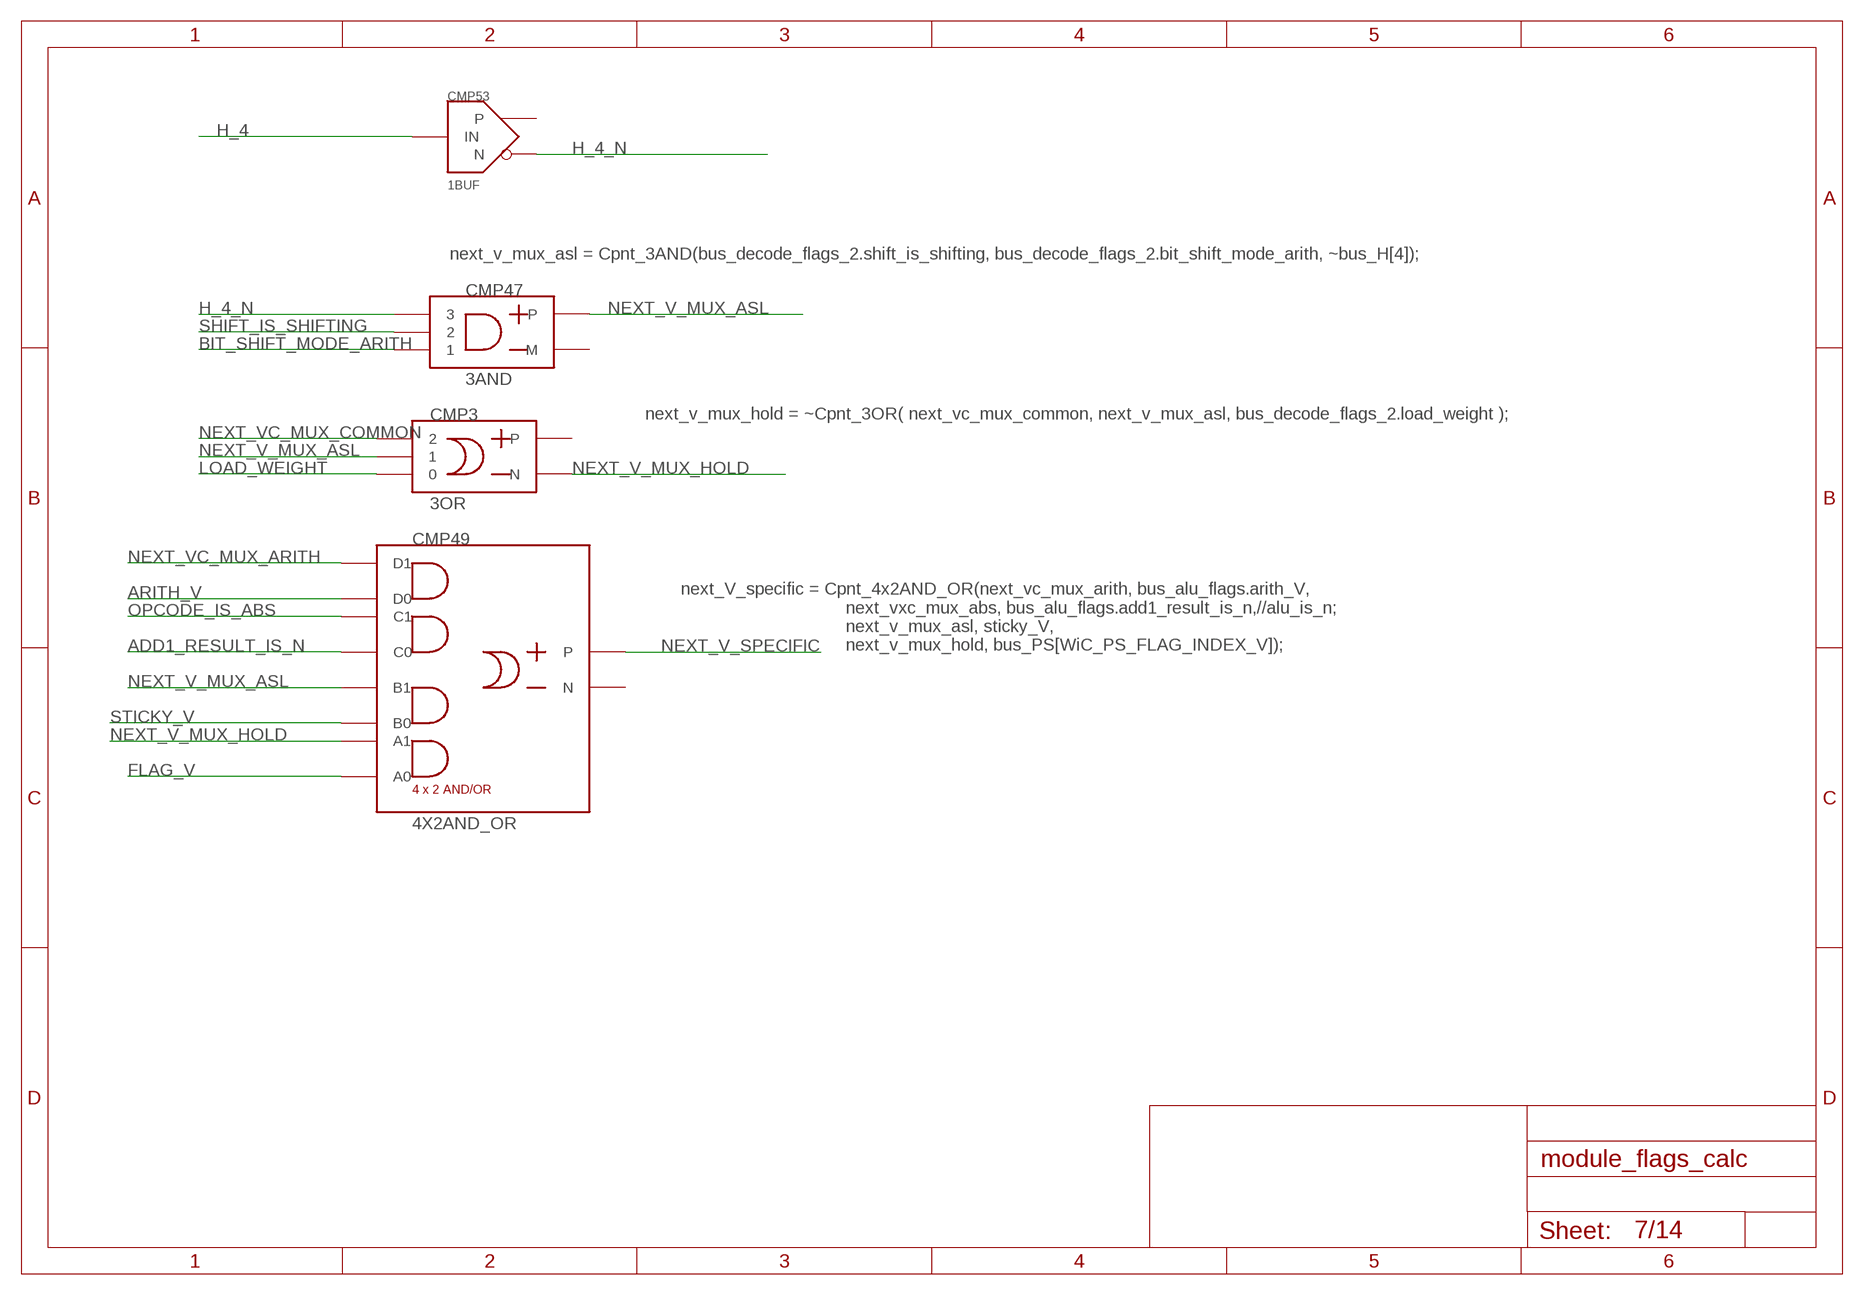
[diagram p6: schematic, sheet 7]

### Parts
CMP3  3OR  [3OR]
CMP47  3AND  [3AND]
CMP49  4X2AND_OR  [4X2AND_OR]
CMP53  1BUF  [1BUF]

### Nets
ADD1_RESULT_IS_N: CMP49.P$5(C0) ; also sheet 1
ARITH_V: CMP49.P$7(D0) ; also sheet 1
BIT_SHIFT_MODE_ARITH: CMP47.P$1 ; also sheet 3
FLAG_V: CMP49.P$1(A0) ; also sheet 2,5
H_4: CMP53.IN ; also sheet 2
H_4_N: CMP47.P$3 CMP53.N
LOAD_WEIGHT: CMP3.P$1 ; also sheet 3,8,9,10,11
NEXT_V_MUX_ASL: CMP3.P$2 CMP47.OUT_P(P) CMP49.P$4(B1)
NEXT_V_MUX_HOLD: CMP3.OUT_M(N) CMP49.P$2(A1)
NEXT_V_SPECIFIC: CMP49.OUT_P(P) ; also sheet 4
NEXT_VC_MUX_ARITH: CMP49.P$8(D1) ; also sheet 5,6,8
NEXT_VC_MUX_COMMON: CMP3.P$3 ; also sheet 6,8
OPCODE_IS_ABS: CMP49.P$6(C1) ; also sheet 3,6,8,9
SHIFT_IS_SHIFTING: CMP47.P$2 ; also sheet 3,8,10
STICKY_V: CMP49.P$3(B0) ; also sheet 5
Unconnected: CMP3.OUT_P(P) CMP47.OUT_M(M) CMP49.OUT_M(N) CMP53.P

### Notes on the sheet
- next_v_mux_asl = Cpnt_3AND(bus_decode_flags_2.shift_is_shifting, bus_decode_flags_2.bit_shift_mode_arith, ~bus_H[4]);
- next_v_mux_hold = ~Cpnt_3OR( next_vc_mux_common, next_v_mux_asl, bus_decode_flags_2.load_weight );
- next_V_specific = Cpnt_4x2AND_OR(next_vc_mux_arith, bus_alu_flags.arith_V,
                                       next_vxc_mux_abs, bus_alu_flags.add1_result_is_n,//alu_is_n;
                                       next_v_mux_asl, sticky_V,
                                       next_v_mux_hold, bus_PS[WiC_PS_FLAG_INDEX_V]);

## Sheet 8 of 14
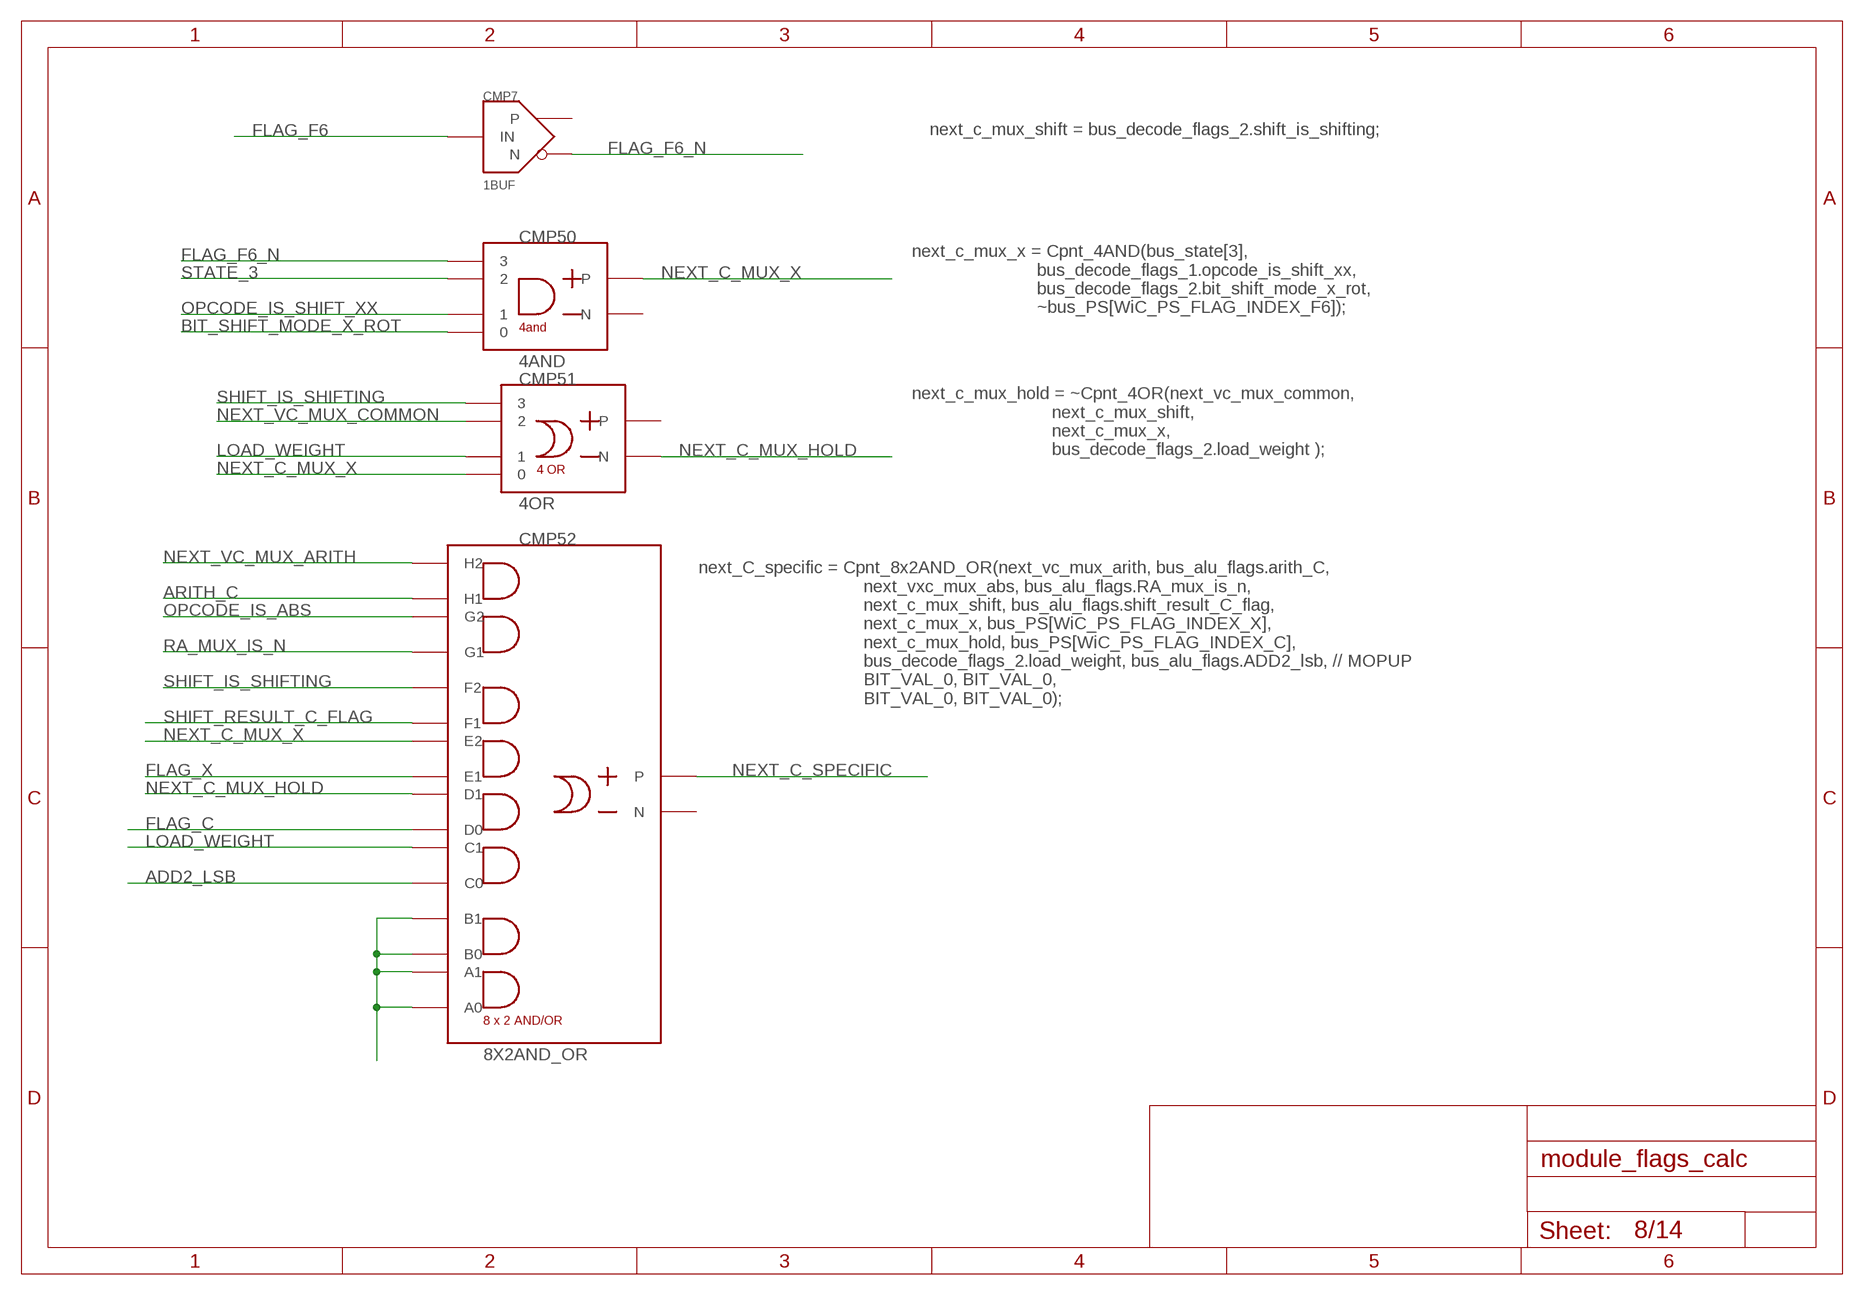
[diagram p7: schematic, sheet 8]

### Parts
CMP7  1BUF  [1BUF]
CMP50  4AND  [4AND]
CMP51  4OR  [4OR]
CMP52  8X2AND_OR  [8X2AND_OR]

### Nets
ADD2_LSB: CMP52.P$5(C0) ; also sheet 1
ARITH_C: CMP52.P$15(H1) ; also sheet 1
BIT_SHIFT_MODE_X_ROT: CMP50.P$1 ; also sheet 3
FLAG_C: CMP52.P$7(D0) ; also sheet 2
FLAG_F6: CMP7.IN ; also sheet 2,13
FLAG_F6_N: CMP7.N CMP50.P$4
FLAG_X: CMP52.P$9(E1) ; also sheet 2,9
LOAD_WEIGHT: CMP51.2 CMP52.P$6(C1) ; also sheet 3,7,9,10,11
N$10: CMP52.P$1(A0) CMP52.P$2(A1) CMP52.P$3(B0) CMP52.P$4(B1)
NEXT_C_MUX_HOLD: CMP51.OUT_M(N) CMP52.P$8(D1)
NEXT_C_MUX_X: CMP50.OUT_P(P) CMP51.1 CMP52.P$10(E2)
NEXT_C_SPECIFIC: CMP52.OUT_P(P) ; also sheet 4,9
NEXT_VC_MUX_ARITH: CMP52.P$16(H2) ; also sheet 5,6,7
NEXT_VC_MUX_COMMON: CMP51.3 ; also sheet 6,7
OPCODE_IS_ABS: CMP52.P$14(G2) ; also sheet 3,6,7,9
OPCODE_IS_SHIFT_XX: CMP50.P$2 ; also sheet 3,10
RA_MUX_IS_N: CMP52.P$13(G1) ; also sheet 1,9,10
SHIFT_IS_SHIFTING: CMP51.4 CMP52.P$12(F2) ; also sheet 3,7,10
SHIFT_RESULT_C_FLAG: CMP52.P$11(F1) ; also sheet 1
STATE_3: CMP50.P$3 ; also sheet 2,5,6,11,14
Unconnected: CMP7.P CMP50.OUT_M(N) CMP51.OUT_P(P) CMP52.OUT_M(N)

### Notes on the sheet
- next_c_mux_shift = bus_decode_flags_2.shift_is_shifting;
- next_c_mux_x = Cpnt_4AND(bus_state[3],
                               bus_decode_flags_1.opcode_is_shift_xx,
                               bus_decode_flags_2.bit_shift_mode_x_rot,
                               ~bus_PS[WiC_PS_FLAG_INDEX_F6]);
- next_c_mux_hold = ~Cpnt_4OR(next_vc_mux_common,
                                  next_c_mux_shift,
                                  next_c_mux_x,
                                  bus_decode_flags_2.load_weight );
- next_C_specific = Cpnt_8x2AND_OR(next_vc_mux_arith, bus_alu_flags.arith_C,
                                       next_vxc_mux_abs, bus_alu_flags.RA_mux_is_n,
                                       next_c_mux_shift, bus_alu_flags.shift_result_C_flag,
                                       next_c_mux_x, bus_PS[WiC_PS_FLAG_INDEX_X],
                                       next_c_mux_hold, bus_PS[WiC_PS_FLAG_INDEX_C],
                                       bus_decode_flags_2.load_weight, bus_alu_flags.ADD2_lsb, // MOPUP
                                       BIT_VAL_0, BIT_VAL_0,
                                       BIT_VAL_0, BIT_VAL_0);

## Sheet 9 of 14
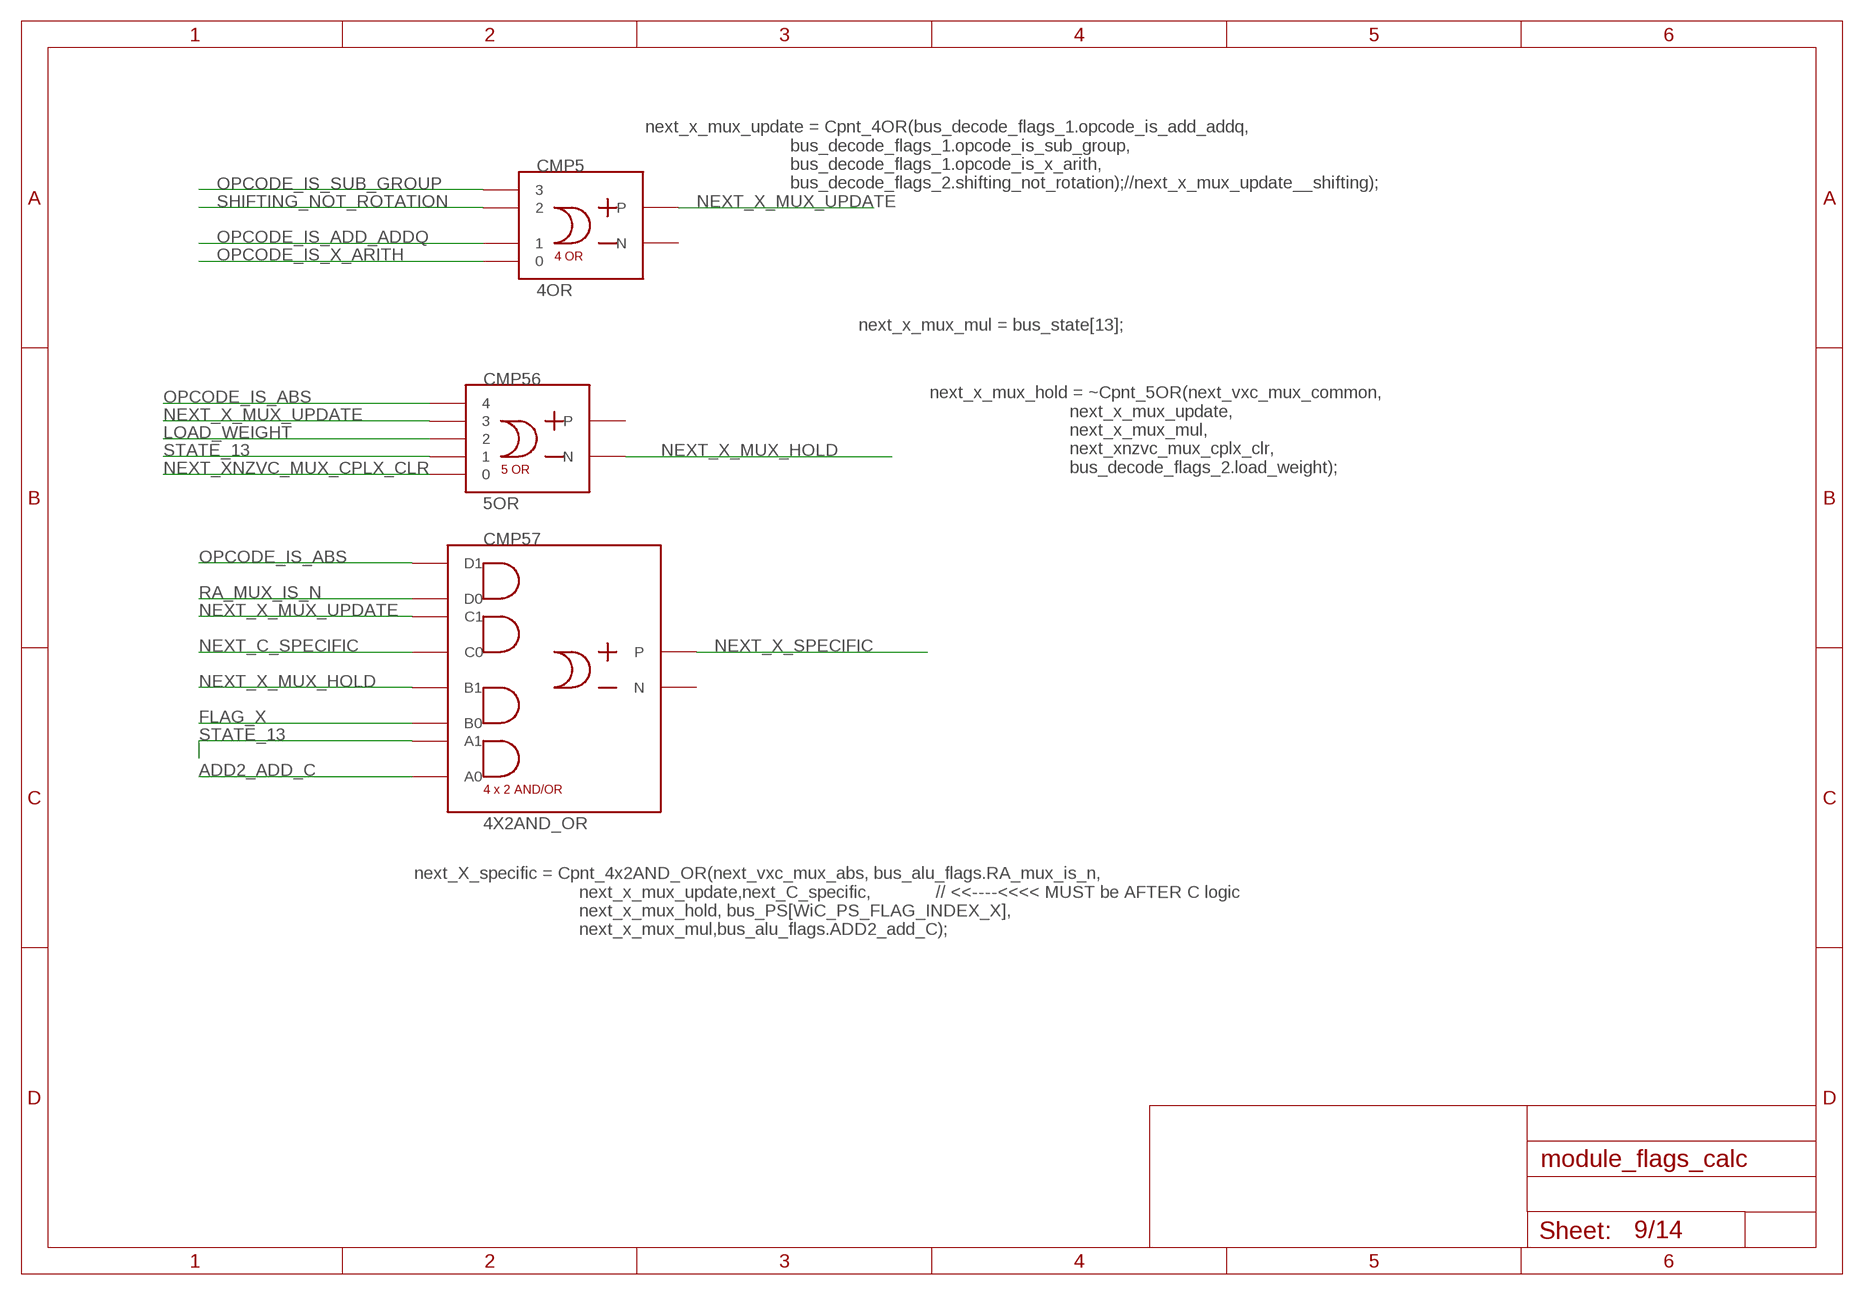
[diagram p8: schematic, sheet 9]

### Parts
CMP5  4OR  [4OR]
CMP56  5OR  [5OR]
CMP57  4X2AND_OR  [4X2AND_OR]

### Nets
ADD2_ADD_C: CMP57.P$1(A0) ; also sheet 1
FLAG_X: CMP57.P$3(B0) ; also sheet 2,8
LOAD_WEIGHT: CMP56.3 ; also sheet 3,7,8,10,11
NEXT_C_SPECIFIC: CMP57.P$5(C0) ; also sheet 4,8
NEXT_X_MUX_HOLD: CMP56.OUT_M(N) CMP57.P$4(B1)
NEXT_X_MUX_UPDATE: CMP5.OUT_P(P) CMP56.4 CMP57.P$6(C1)
NEXT_X_SPECIFIC: CMP57.OUT_P(P) ; also sheet 4
NEXT_XNZVC_MUX_CPLX_CLR: CMP56.1 ; also sheet 5,10,11
OPCODE_IS_ABS: CMP56.5 CMP57.P$8(D1) ; also sheet 3,6,7,8
OPCODE_IS_ADD_ADDQ: CMP5.2 ; also sheet 3,5
OPCODE_IS_SUB_GROUP: CMP5.4 ; also sheet 3
OPCODE_IS_X_ARITH: CMP5.1 ; also sheet 3,5,10,11
RA_MUX_IS_N: CMP57.P$7(D0) ; also sheet 1,8,10
SHIFTING_NOT_ROTATION: CMP5.3 ; also sheet 3
STATE_13: CMP56.2 CMP57.P$2(A1) ; also sheet 2,12
Unconnected: CMP5.OUT_M(N) CMP56.OUT_P(P) CMP57.OUT_M(N)

### Notes on the sheet
- next_x_mux_update = Cpnt_4OR(bus_decode_flags_1.opcode_is_add_addq,
                                   bus_decode_flags_1.opcode_is_sub_group,
                                   bus_decode_flags_1.opcode_is_x_arith,
                                   bus_decode_flags_2.shifting_not_rotation);//next_x_mux_update__shifting);
- next_x_mux_mul = bus_state[13];
- next_x_mux_hold = ~Cpnt_5OR(next_vxc_mux_common,
                                  next_x_mux_update, 
                                  next_x_mux_mul, 
                                  next_xnzvc_mux_cplx_clr,
                                  bus_decode_flags_2.load_weight);
- next_X_specific = Cpnt_4x2AND_OR(next_vxc_mux_abs, bus_alu_flags.RA_mux_is_n,
                                       next_x_mux_update,next_C_specific,             // <<----<<<< MUST be AFTER C logic
                                       next_x_mux_hold, bus_PS[WiC_PS_FLAG_INDEX_X],
                                       next_x_mux_mul,bus_alu_flags.ADD2_add_C);

## Sheet 10 of 14
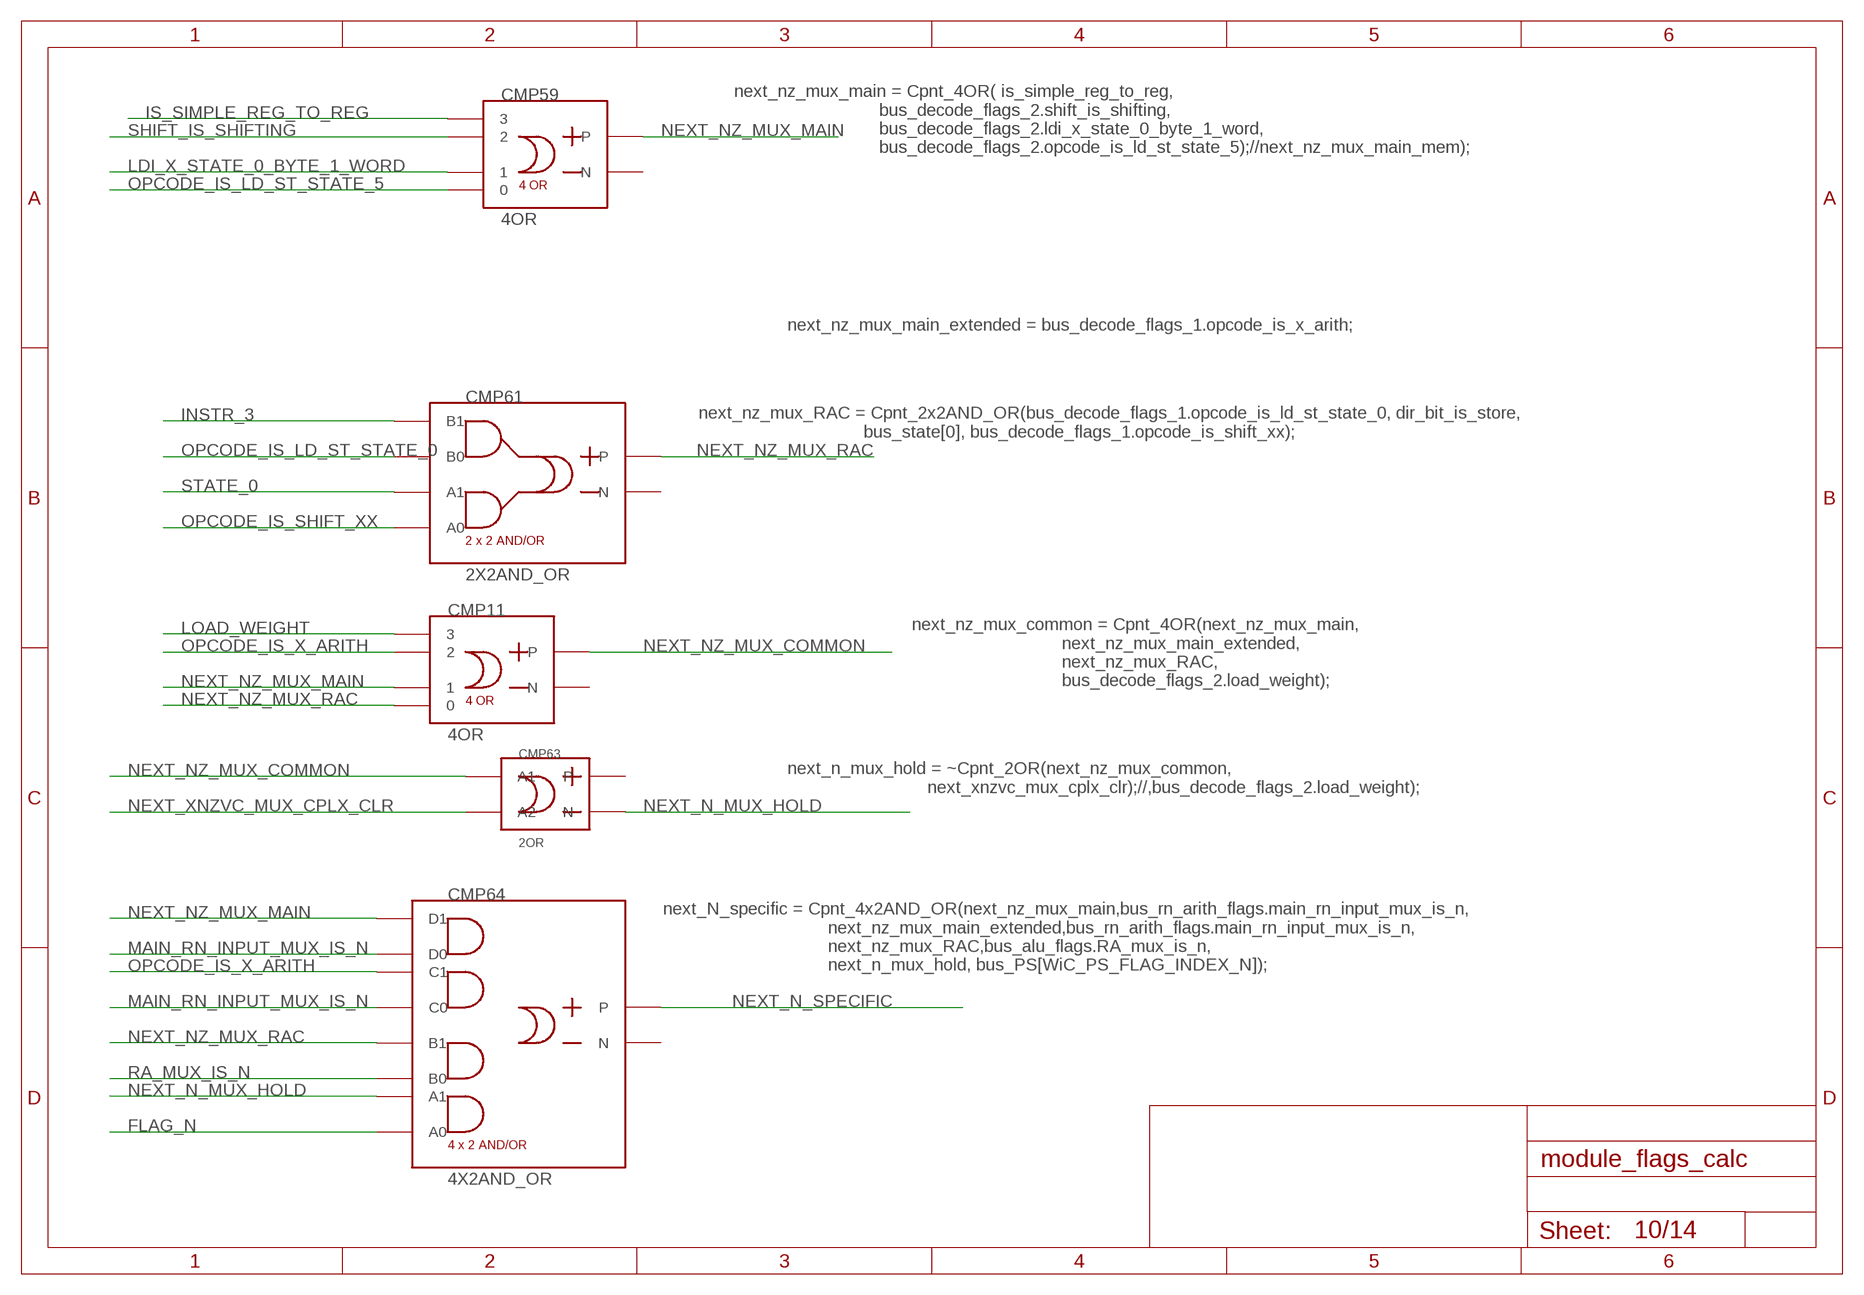
[diagram p9: schematic, sheet 10]

### Parts
CMP11  4OR  [4OR]
CMP59  4OR  [4OR]
CMP61  2X2AND_OR  [2X2AND_OR]
CMP63  2OR  [2OR]
CMP64  4X2AND_OR  [4X2AND_OR]

### Nets
FLAG_N: CMP64.P$1(A0) ; also sheet 2
INSTR_3: CMP61.P$4(B1) ; also sheet 2,3
IS_SIMPLE_REG_TO_REG: CMP59.4 ; also sheet 2
LDI_X_STATE_0_BYTE_1_WORD: CMP59.2 ; also sheet 3
LOAD_WEIGHT: CMP11.4 ; also sheet 3,7,8,9,11
MAIN_RN_INPUT_MUX_IS_N: CMP64.P$5(C0) CMP64.P$7(D0) ; also sheet 1
NEXT_N_MUX_HOLD: CMP63.OUT_M(N) CMP64.P$2(A1)
NEXT_N_SPECIFIC: CMP64.OUT_P(P) ; also sheet 4
NEXT_NZ_MUX_COMMON: CMP11.OUT_P(P) CMP63.P$2(A1) ; also sheet 11
NEXT_NZ_MUX_MAIN: CMP11.2 CMP59.OUT_P(P) CMP64.P$8(D1) ; also sheet 11
NEXT_NZ_MUX_RAC: CMP11.1 CMP61.OUT_P(P) CMP64.P$4(B1) ; also sheet 11
NEXT_XNZVC_MUX_CPLX_CLR: CMP63.P$1(A2) ; also sheet 5,9,11
OPCODE_IS_LD_ST_STATE_0: CMP61.P$3(B0) ; also sheet 3
OPCODE_IS_LD_ST_STATE_5: CMP59.1 ; also sheet 3
OPCODE_IS_SHIFT_XX: CMP61.P$1(A0) ; also sheet 3,8
OPCODE_IS_X_ARITH: CMP11.3 CMP64.P$6(C1) ; also sheet 3,5,9,11
RA_MUX_IS_N: CMP64.P$3(B0) ; also sheet 1,8,9
SHIFT_IS_SHIFTING: CMP59.3 ; also sheet 3,7,8
STATE_0: CMP61.P$2(A1) ; also sheet 2,6,12
Unconnected: CMP11.OUT_M(N) CMP59.OUT_M(N) CMP61.OUT_M(N) CMP63.OUT_P(P) CMP64.OUT_M(N)

### Notes on the sheet
- next_nz_mux_main = Cpnt_4OR( is_simple_reg_to_reg,
                                   bus_decode_flags_2.shift_is_shifting,
                                   bus_decode_flags_2.ldi_x_state_0_byte_1_word,
                                   bus_decode_flags_2.opcode_is_ld_st_state_5);//next_nz_mux_main_mem);
- next_nz_mux_main_extended = bus_decode_flags_1.opcode_is_x_arith;
- next_nz_mux_RAC = Cpnt_2x2AND_OR(bus_decode_flags_1.opcode_is_ld_st_state_0, dir_bit_is_store, 
                                       bus_state[0], bus_decode_flags_1.opcode_is_shift_xx);
- next_nz_mux_common = Cpnt_4OR(next_nz_mux_main,
                                    next_nz_mux_main_extended,
                                    next_nz_mux_RAC,
                                    bus_decode_flags_2.load_weight);
- next_n_mux_hold = ~Cpnt_2OR(next_nz_mux_common,
                                  next_xnzvc_mux_cplx_clr);//,bus_decode_flags_2.load_weight);
- next_N_specific = Cpnt_4x2AND_OR(next_nz_mux_main,bus_rn_arith_flags.main_rn_input_mux_is_n,
                                       next_nz_mux_main_extended,bus_rn_arith_flags.main_rn_input_mux_is_n,
                                       next_nz_mux_RAC,bus_alu_flags.RA_mux_is_n,
                                       next_n_mux_hold, bus_PS[WiC_PS_FLAG_INDEX_N]);

## Sheet 11 of 14
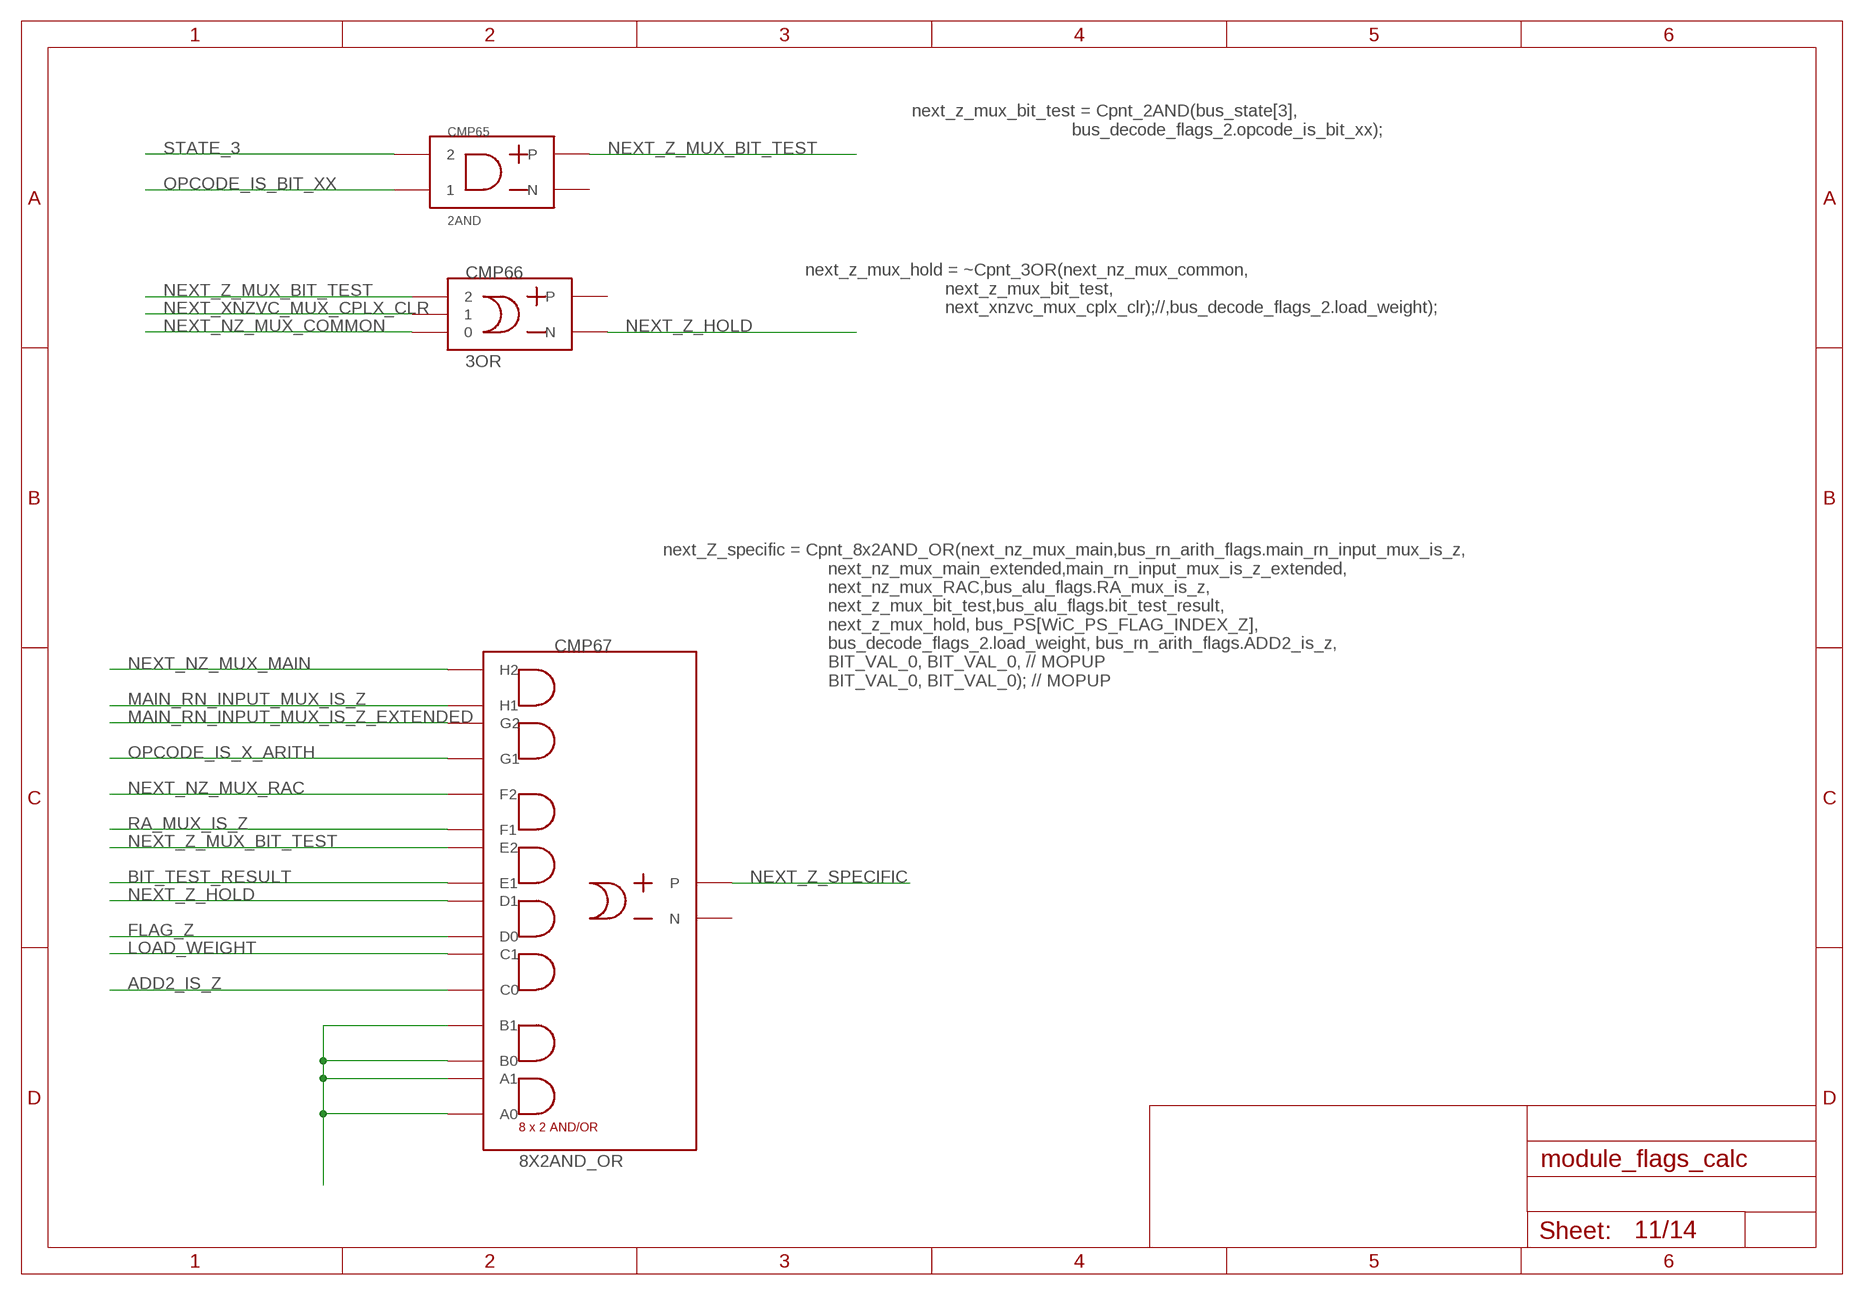
[diagram p10: schematic, sheet 11]

### Parts
CMP65  2AND  [2AND]
CMP66  3OR  [3OR]
CMP67  8X2AND_OR  [8X2AND_OR]

### Nets
ADD2_IS_Z: CMP67.P$5(C0) ; also sheet 1
BIT_TEST_RESULT: CMP67.P$9(E1) ; also sheet 1
FLAG_Z: CMP67.P$7(D0) ; also sheet 2,5
LOAD_WEIGHT: CMP67.P$6(C1) ; also sheet 3,7,8,9,10
MAIN_RN_INPUT_MUX_IS_Z: CMP67.P$15(H1) ; also sheet 1,5
MAIN_RN_INPUT_MUX_IS_Z_EXTENDED: CMP67.P$14(G2) ; also sheet 5
N$16: CMP67.P$1(A0) CMP67.P$2(A1) CMP67.P$3(B0) CMP67.P$4(B1)
NEXT_NZ_MUX_COMMON: CMP66.P$1 ; also sheet 10
NEXT_NZ_MUX_MAIN: CMP67.P$16(H2) ; also sheet 10
NEXT_NZ_MUX_RAC: CMP67.P$12(F2) ; also sheet 10
NEXT_XNZVC_MUX_CPLX_CLR: CMP66.P$2 ; also sheet 5,9,10
NEXT_Z_HOLD: CMP66.OUT_M(N) CMP67.P$8(D1)
NEXT_Z_MUX_BIT_TEST: CMP65.OUT_P(P) CMP66.P$3 CMP67.P$10(E2)
NEXT_Z_SPECIFIC: CMP67.OUT_P(P) ; also sheet 4
OPCODE_IS_BIT_XX: CMP65.P$1 ; also sheet 3
OPCODE_IS_X_ARITH: CMP67.P$13(G1) ; also sheet 3,5,9,10
RA_MUX_IS_Z: CMP67.P$11(F1) ; also sheet 1
STATE_3: CMP65.P$2 ; also sheet 2,5,6,8,14
Unconnected: CMP65.OUT_M(N) CMP66.OUT_P(P) CMP67.OUT_M(N)

### Notes on the sheet
- next_z_mux_bit_test = Cpnt_2AND(bus_state[3],
                                      bus_decode_flags_2.opcode_is_bit_xx);
- next_z_mux_hold = ~Cpnt_3OR(next_nz_mux_common,
                                  next_z_mux_bit_test,
                                  next_xnzvc_mux_cplx_clr);//,bus_decode_flags_2.load_weight);
- next_Z_specific = Cpnt_8x2AND_OR(next_nz_mux_main,bus_rn_arith_flags.main_rn_input_mux_is_z,
                                       next_nz_mux_main_extended,main_rn_input_mux_is_z_extended,
                                       next_nz_mux_RAC,bus_alu_flags.RA_mux_is_z,
                                       next_z_mux_bit_test,bus_alu_flags.bit_test_result,
                                       next_z_mux_hold, bus_PS[WiC_PS_FLAG_INDEX_Z],
                                       bus_decode_flags_2.load_weight, bus_rn_arith_flags.ADD2_is_z,
                                       BIT_VAL_0, BIT_VAL_0, // MOPUP
                                       BIT_VAL_0, BIT_VAL_0); // MOPUP

## Sheet 12 of 14
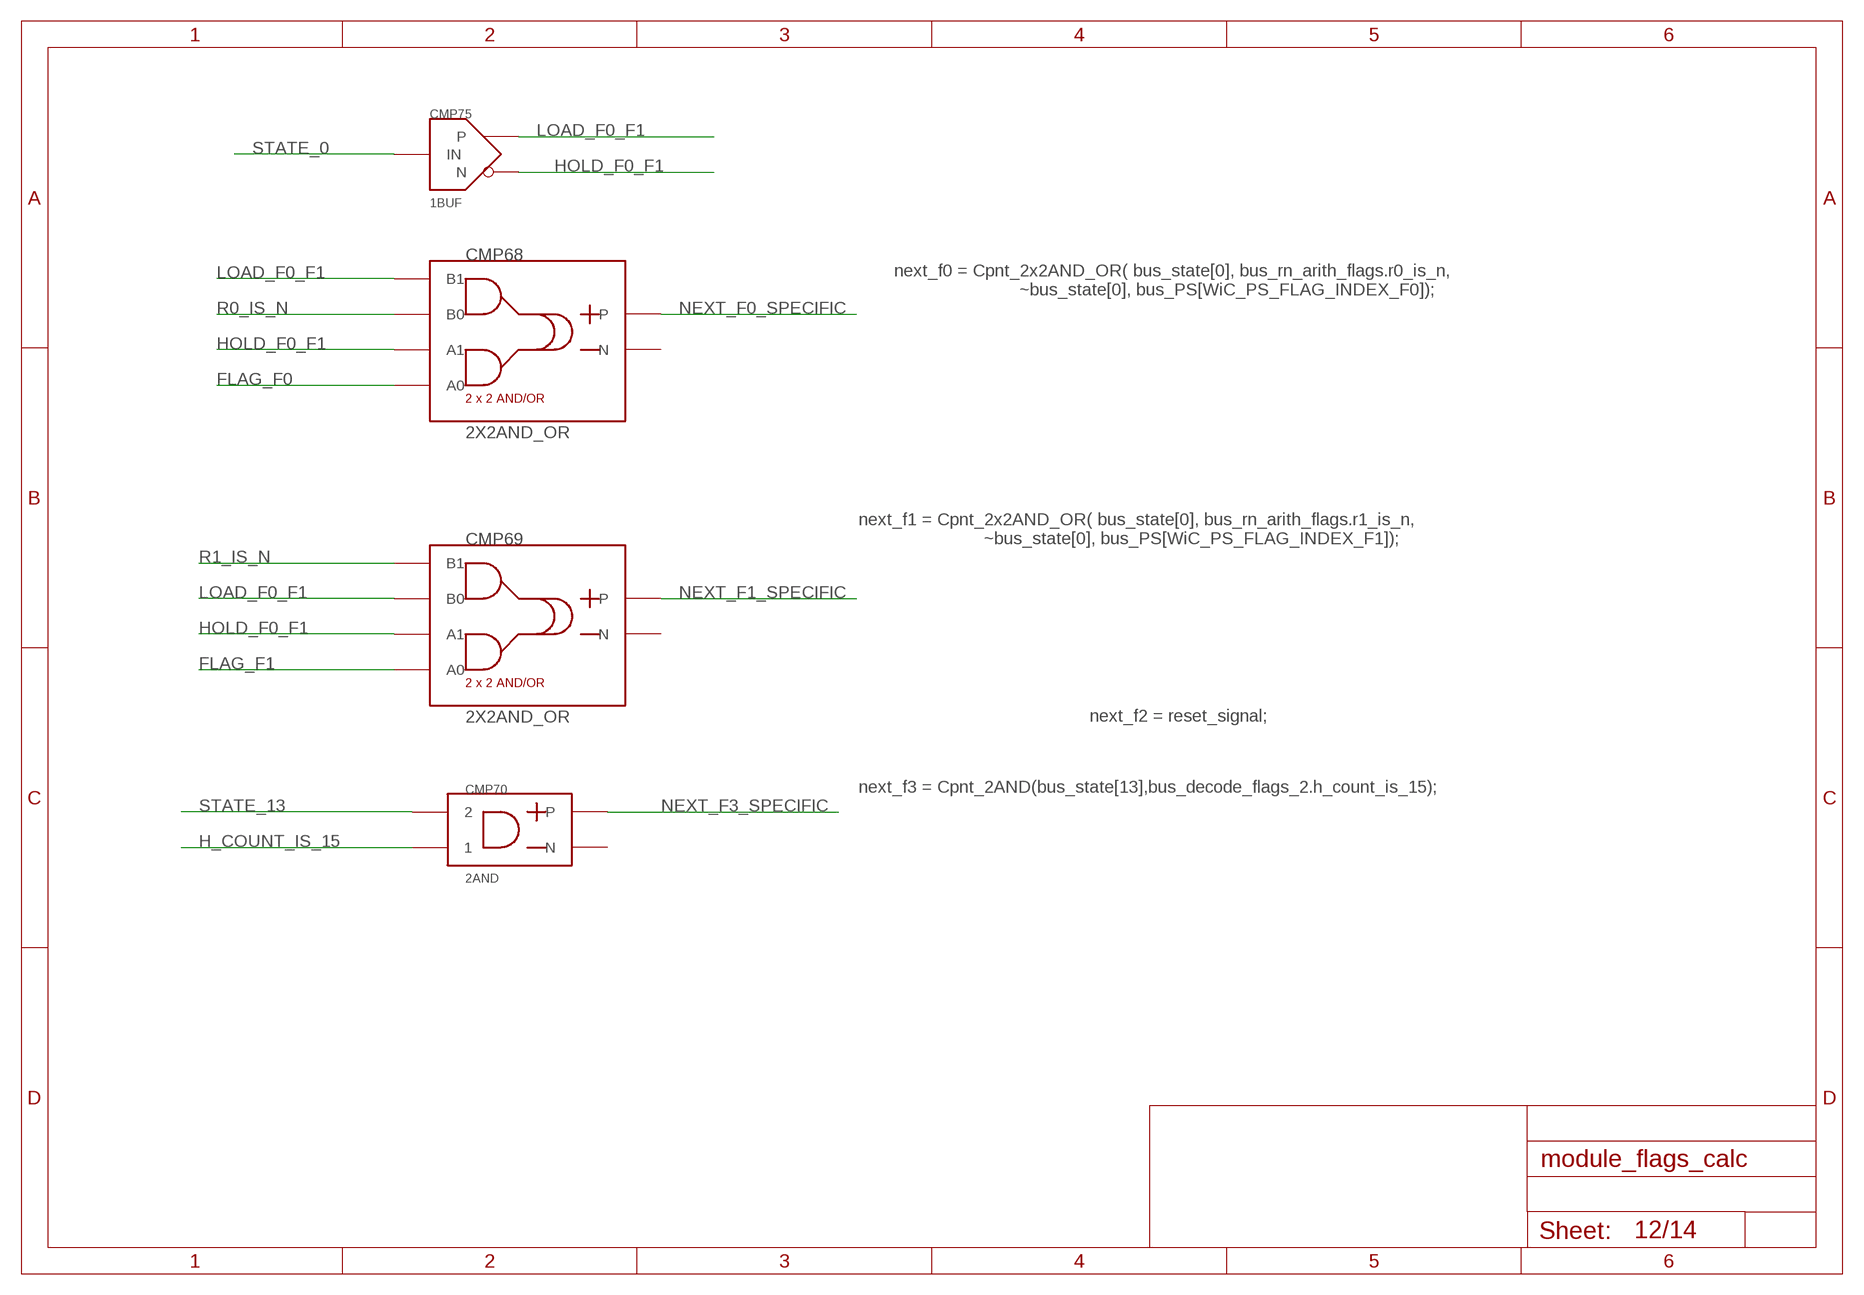
[diagram p11: schematic, sheet 12]

### Parts
CMP68  2X2AND_OR  [2X2AND_OR]
CMP69  2X2AND_OR  [2X2AND_OR]
CMP70  2AND  [2AND]
CMP75  1BUF  [1BUF]

### Nets
FLAG_F0: CMP68.P$1(A0) ; also sheet 2
FLAG_F1: CMP69.P$1(A0) ; also sheet 2
H_COUNT_IS_15: CMP70.P$1 ; also sheet 3
HOLD_F0_F1: CMP68.P$2(A1) CMP69.P$2(A1) CMP75.N
LOAD_F0_F1: CMP68.P$4(B1) CMP69.P$3(B0) CMP75.P
NEXT_F0_SPECIFIC: CMP68.OUT_P(P) ; also sheet 4
NEXT_F1_SPECIFIC: CMP69.OUT_P(P) ; also sheet 4
NEXT_F3_SPECIFIC: CMP70.OUT_P(P) ; also sheet 4
R0_IS_N: CMP68.P$3(B0) ; also sheet 1
R1_IS_N: CMP69.P$4(B1) ; also sheet 1
STATE_0: CMP75.IN ; also sheet 2,6,10
STATE_13: CMP70.P$2 ; also sheet 2,9
Unconnected: CMP68.OUT_M(N) CMP69.OUT_M(N) CMP70.OUT_M(N)

### Notes on the sheet
- next_f0 = Cpnt_2x2AND_OR( bus_state[0], bus_rn_arith_flags.r0_is_n,
                               ~bus_state[0], bus_PS[WiC_PS_FLAG_INDEX_F0]);
- next_f1 = Cpnt_2x2AND_OR( bus_state[0], bus_rn_arith_flags.r1_is_n,
                               ~bus_state[0], bus_PS[WiC_PS_FLAG_INDEX_F1]);
- next_f2 = reset_signal;
- next_f3 = Cpnt_2AND(bus_state[13],bus_decode_flags_2.h_count_is_15);

## Sheet 13 of 14
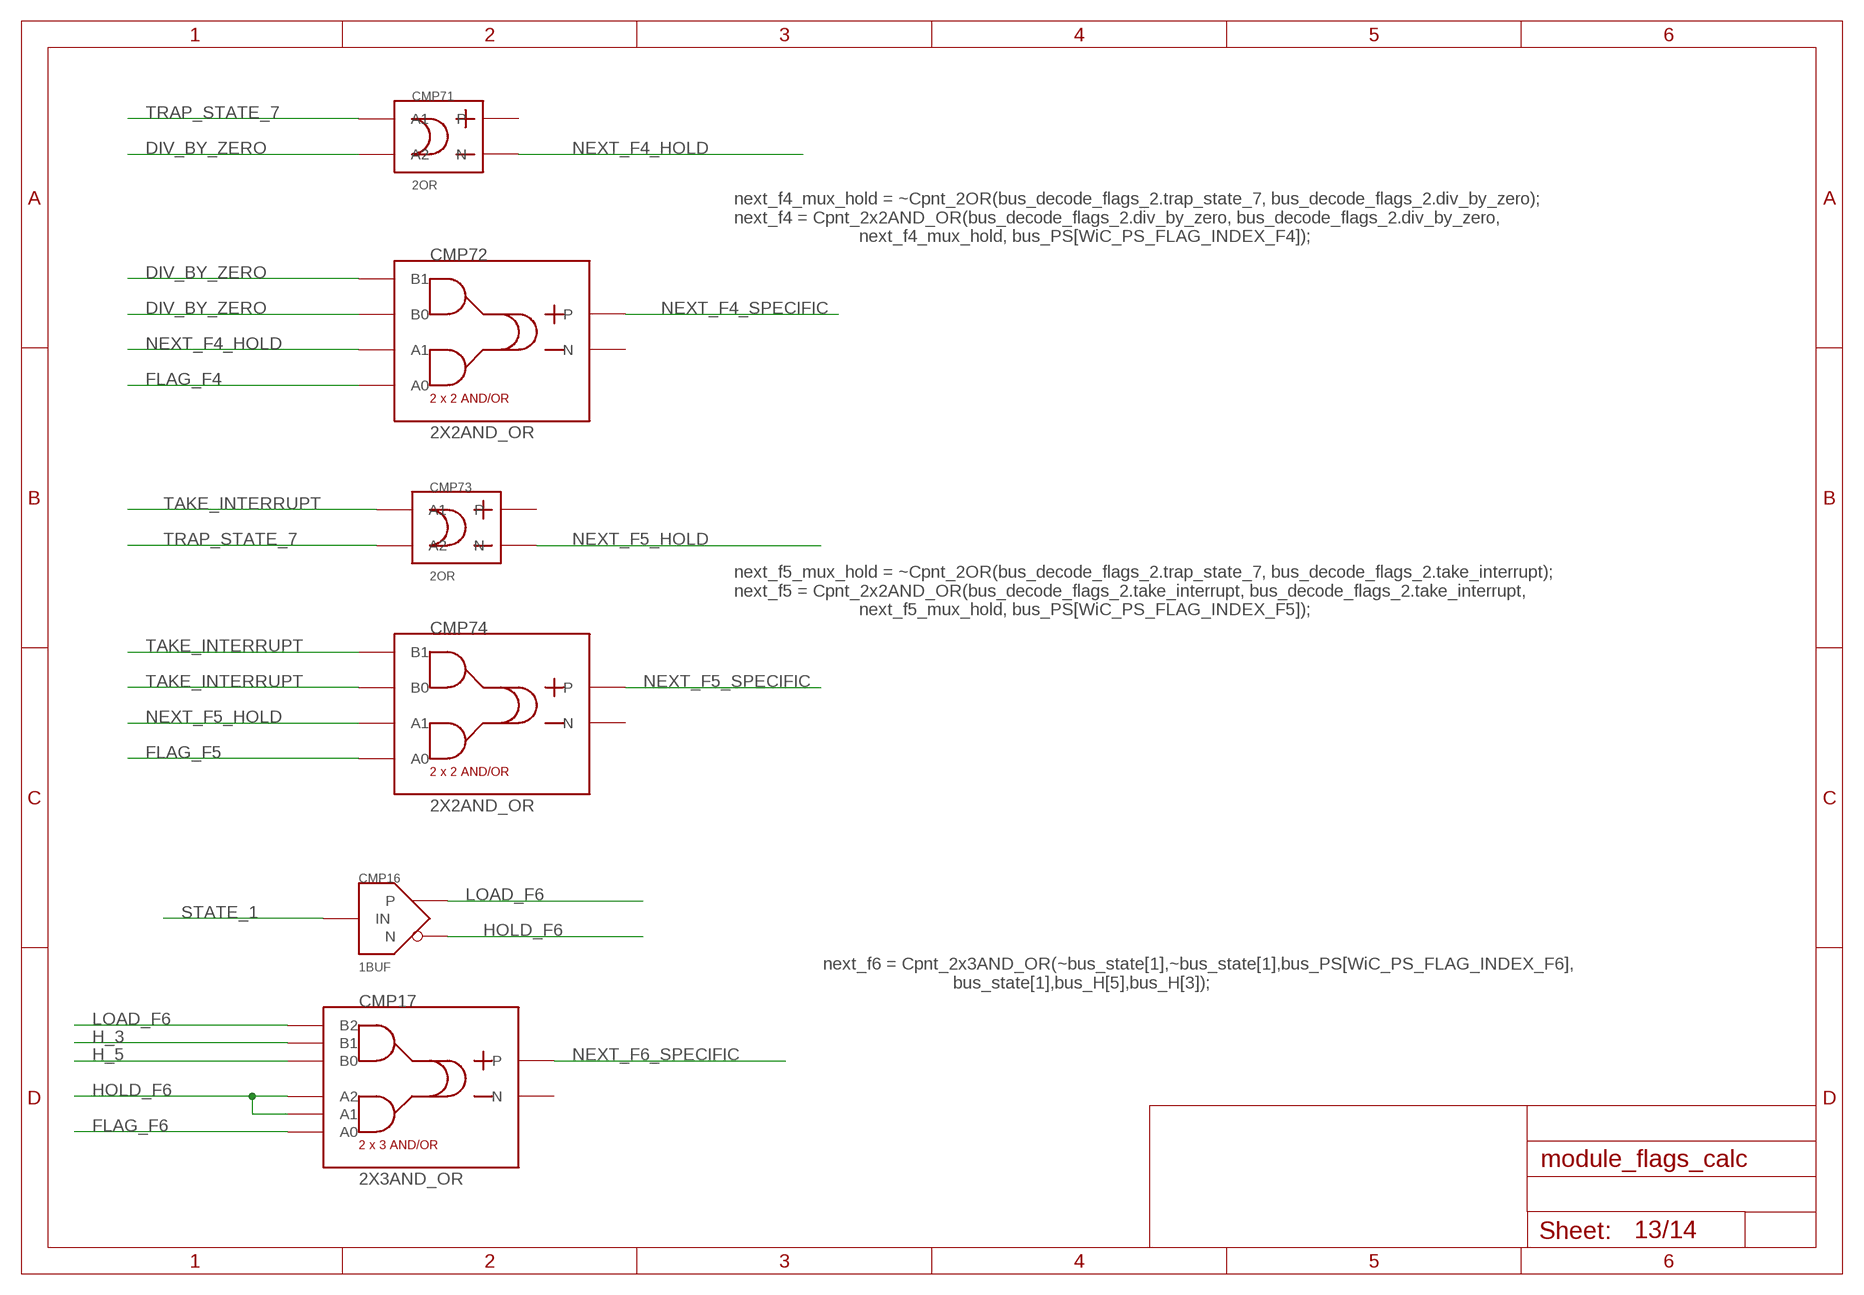
[diagram p12: schematic, sheet 13]

### Parts
CMP16  1BUF  [1BUF]
CMP17  2X3AND_OR  [2X3AND_OR]
CMP71  2OR  [2OR]
CMP72  2X2AND_OR  [2X2AND_OR]
CMP73  2OR  [2OR]
CMP74  2X2AND_OR  [2X2AND_OR]

### Nets
DIV_BY_ZERO: CMP71.P$1(A2) CMP72.P$3(B0) CMP72.P$4(B1) ; also sheet 3
FLAG_F4: CMP72.P$1(A0) ; also sheet 2
FLAG_F5: CMP74.P$1(A0) ; also sheet 2
FLAG_F6: CMP17.P$1(A0) ; also sheet 2,8
H_3: CMP17.P$5(B1) ; also sheet 2
H_5: CMP17.P$4(B0) ; also sheet 2
HOLD_F6: CMP16.N CMP17.P$2(A1) CMP17.P$3(A2)
LOAD_F6: CMP16.P CMP17.P$6(B2)
NEXT_F4_HOLD: CMP71.OUT_M(N) CMP72.P$2(A1)
NEXT_F4_SPECIFIC: CMP72.OUT_P(P) ; also sheet 4
NEXT_F5_HOLD: CMP73.OUT_M(N) CMP74.P$2(A1)
NEXT_F5_SPECIFIC: CMP74.OUT_P(P) ; also sheet 4
NEXT_F6_SPECIFIC: CMP17.OUT_P(P) ; also sheet 4
STATE_1: CMP16.IN ; also sheet 2
TAKE_INTERRUPT: CMP73.P$2(A1) CMP74.P$3(B0) CMP74.P$4(B1) ; also sheet 3
TRAP_STATE_7: CMP71.P$2(A1) CMP73.P$1(A2) ; also sheet 3
Unconnected: CMP17.OUT_M(N) CMP71.OUT_P(P) CMP72.OUT_M(N) CMP73.OUT_P(P) CMP74.OUT_M(N)

### Notes on the sheet
- next_f4_mux_hold = ~Cpnt_2OR(bus_decode_flags_2.trap_state_7, bus_decode_flags_2.div_by_zero);
      next_f4 = Cpnt_2x2AND_OR(bus_decode_flags_2.div_by_zero, bus_decode_flags_2.div_by_zero,
                               next_f4_mux_hold, bus_PS[WiC_PS_FLAG_INDEX_F4]);
- next_f5_mux_hold = ~Cpnt_2OR(bus_decode_flags_2.trap_state_7, bus_decode_flags_2.take_interrupt);
      next_f5 = Cpnt_2x2AND_OR(bus_decode_flags_2.take_interrupt, bus_decode_flags_2.take_interrupt,
                               next_f5_mux_hold, bus_PS[WiC_PS_FLAG_INDEX_F5]);
- next_f6 = Cpnt_2x3AND_OR(~bus_state[1],~bus_state[1],bus_PS[WiC_PS_FLAG_INDEX_F6],
                                bus_state[1],bus_H[5],bus_H[3]);

## Sheet 14 of 14
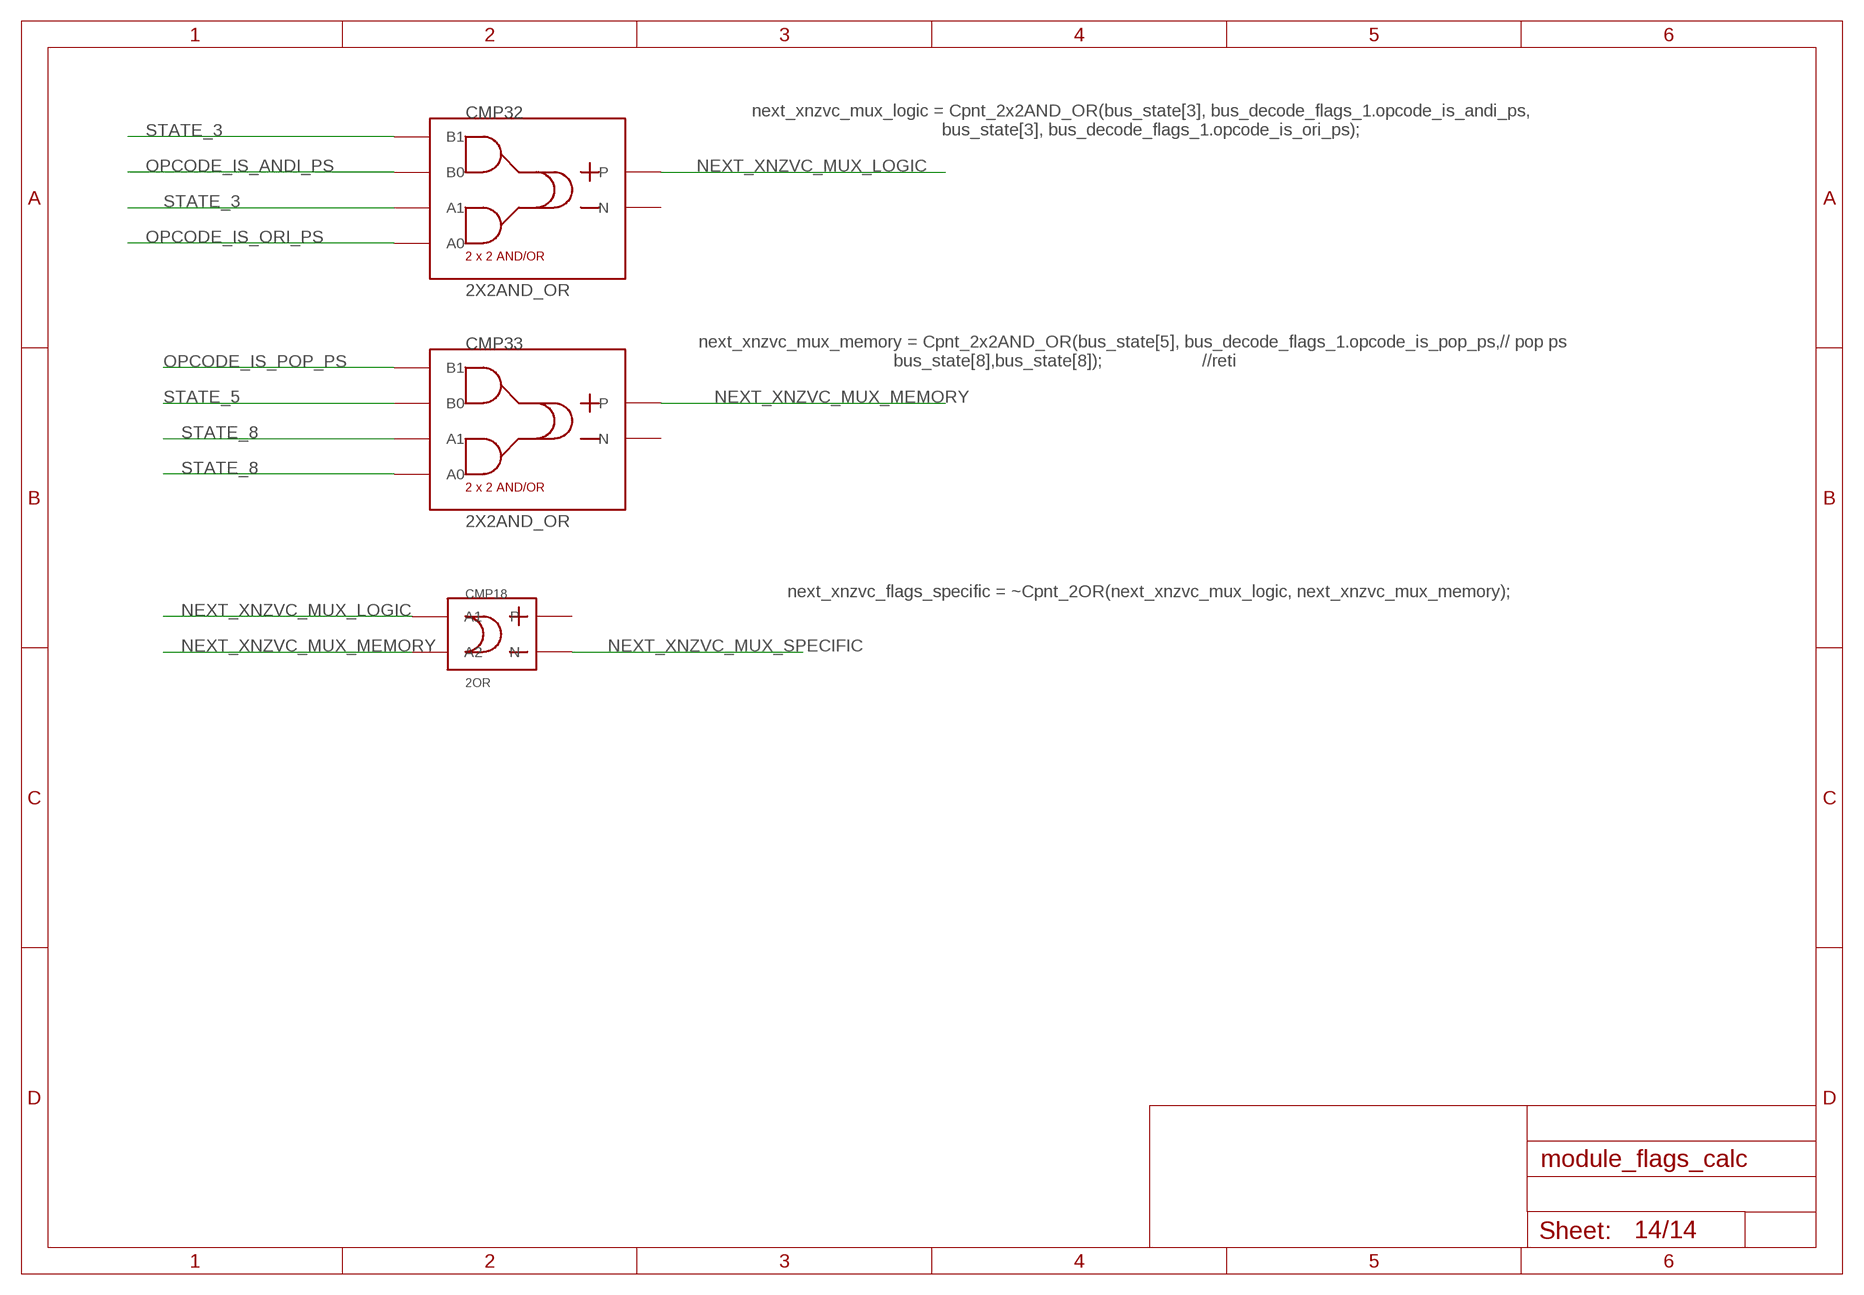
[diagram p13: schematic, sheet 14]

### Parts
CMP18  2OR  [2OR]
CMP32  2X2AND_OR  [2X2AND_OR]
CMP33  2X2AND_OR  [2X2AND_OR]

### Nets
NEXT_XNZVC_MUX_LOGIC: CMP18.P$2(A1) CMP32.OUT_P(P) ; also sheet 3
NEXT_XNZVC_MUX_MEMORY: CMP18.P$1(A2) CMP33.OUT_P(P) ; also sheet 3
NEXT_XNZVC_MUX_SPECIFIC: CMP18.OUT_M(N) ; also sheet 3
OPCODE_IS_ANDI_PS: CMP32.P$3(B0) ; also sheet 3
OPCODE_IS_ORI_PS: CMP32.P$1(A0) ; also sheet 3
OPCODE_IS_POP_PS: CMP33.P$4(B1) ; also sheet 3
STATE_3: CMP32.P$2(A1) CMP32.P$4(B1) ; also sheet 2,5,6,8,11
STATE_5: CMP33.P$3(B0) ; also sheet 2
STATE_8: CMP33.P$1(A0) CMP33.P$2(A1) ; also sheet 2
Unconnected: CMP18.OUT_P(P) CMP32.OUT_M(N) CMP33.OUT_M(N)

### Notes on the sheet
- next_xnzvc_mux_logic = Cpnt_2x2AND_OR(bus_state[3], bus_decode_flags_1.opcode_is_andi_ps,
                                            bus_state[3], bus_decode_flags_1.opcode_is_ori_ps);
- next_xnzvc_mux_memory = Cpnt_2x2AND_OR(bus_state[5], bus_decode_flags_1.opcode_is_pop_ps,// pop ps
                                             bus_state[8],bus_state[8]);                    //reti
- next_xnzvc_flags_specific = ~Cpnt_2OR(next_xnzvc_mux_logic, next_xnzvc_mux_memory);

## Library data of the parts
CMP1 CMP56 = modules:5OR
CMP2 CMP49 CMP57 CMP64 = modules:4X2AND_OR
CMP3 CMP43 CMP66 = modules:3OR
CMP4 CMP6 CMP8-CMP10 CMP12 CMP14 CMP80 = modules:BUS_SPLIT_DISPLAY
CMP5 CMP11 CMP51 CMP59 = modules:4OR
CMP7 CMP16 CMP53 CMP75 = modules:1BUF
CMP13 CMP34 CMP39 CMP65 CMP70 = modules:2AND
CMP15 CMP28 = modules:BUS_CONSTRUCT_DISPLAY
CMP17 = modules:2X3AND_OR
CMP18 CMP31 CMP63 CMP71 CMP73 = modules:2OR
CMP32 CMP33 CMP38 CMP61 CMP68 CMP69 CMP72 CMP74 = modules:2X2AND_OR
CMP47 = modules:3AND
CMP50 = modules:4AND
CMP52 CMP67 = modules:8X2AND_OR